# Altium project EDU_High-Speed-Design.PrjPcb (part 3 of 5)

## Sheet EDU_High-Speed-Design_CPU_SATA.SchDoc: CPU SATA
size 279 x 215 mm; Date: not used; ApprovedBy: not used; CheckedBy: not used; Author: not used; DrawnBy: not used; Engineer: Podlesnyi Vasilii; Organization: not used; Address4: not used; Revision: 0.1; SheetNumber: 22; SheetTotal: 26; ProjectTitle: EDU High-Speed Design; Time: not used; ImagePath: not used; Application_BuildNumber: not used
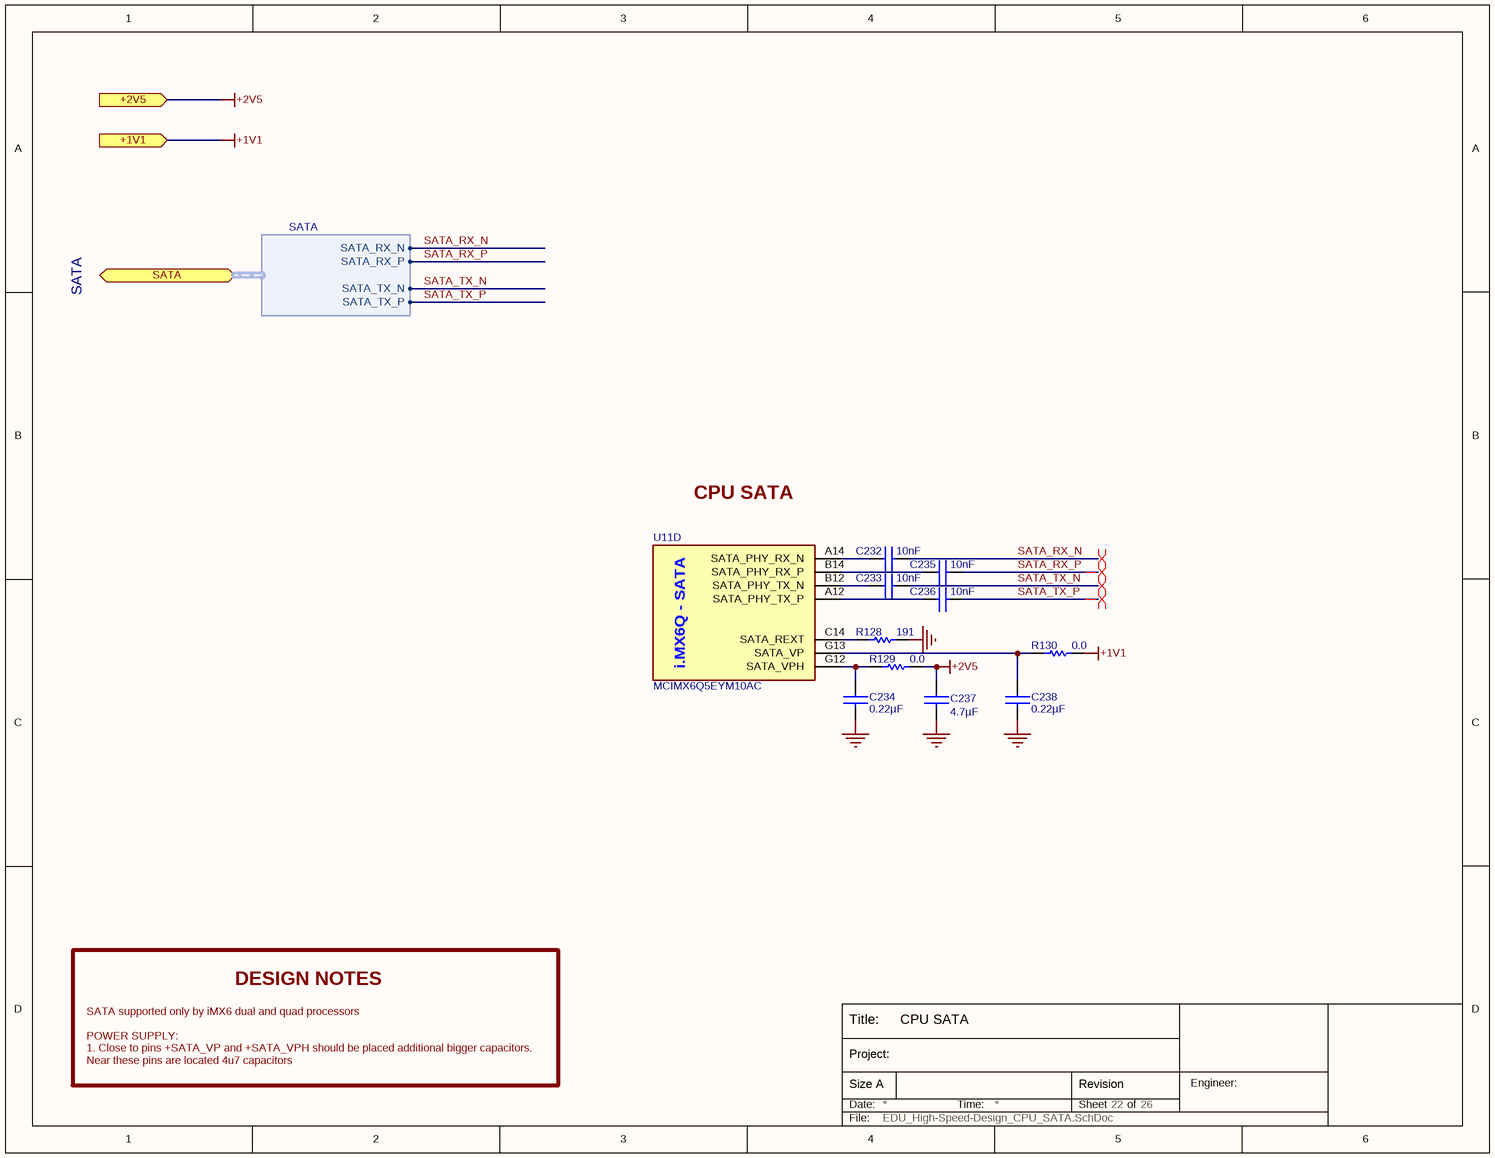
[diagram p19: EDU_High-Speed-Design_CPU_SATA.SchDoc]

### Parts
C232  10nF  [C0402]
C233  10nF  [C0402]
C234  0.22µF  [C0402]
C235  10nF  [C0402]
C236  10nF  [C0402]
C237  4.7µF  [C0402]
C238  0.22µF  [C0402]
R128  191  [R0402]
R129  0.0  [R0402]
R130  0.0  [R0402]
U11  MCIMX6Q5EYM10AC  [MCIMX6Q5EYM10AC]  (part D of 15)

### Ports
+1V1 (in), +2V5 (in), SATA (bidir, harness SATA)

### Harnesses
SATA: SATA_RX_N, SATA_TX_N, SATA_RX_P, SATA_TX_P

### Nets
+1V1: R130.2 ; port +1V1
+2V5: C237.1 R129.2 ; port +2V5
GND: C234.2 C237.2 C238.2 R128.1
SATA_RX_N: C232.2 ; port SATA.SATA_RX_N
SATA_RX_P: C235.2 ; port SATA.SATA_RX_P
SATA_TX_N: C233.2 ; port SATA.SATA_TX_N
SATA_TX_P: C236.2 ; port SATA.SATA_TX_P
NetC232_1: C232.1 U11.A14(SATA_PHY_RX_N)
NetC233_1: C233.1 U11.B12(SATA_PHY_TX_N)
NetC234_1: C234.1 R129.1 U11.G12(SATA_VPH)
NetC235_1: C235.1 U11.B14(SATA_PHY_RX_P)
NetC236_1: C236.1 U11.A12(SATA_PHY_TX_P)
NetC238_1: C238.1 R130.1 U11.G13(SATA_VP)
NetR128_2: R128.2 U11.C14(SATA_REXT)

### Layout directives
differential pair: SATA_RX_N, SATA_RX_P, SATA_TX_N, SATA_TX_P

### Notes on the sheet
- SATA
- CPU SATA
- DESIGN NOTES
- SATA supported only by iMX6 dual and quad processors
  POWER SUPPLY:
  1. Close to pins +SATA_VP and +SATA_VPH should be placed additional bigger capacitors. Near these pins are located 4u7 capacitors
- Title:
- Date:
- Size A
- Project:
- Time:
- Sheet
- Revision
- of
- Engineer:
- File:
- (in symbol MCIMX6Q5EYM10AC, part D) i.MX6Q - SATA

### Library data of the parts
C232 C233 C235 C236 = C1005X7R1H103K: CAP CER 10000PF 50V 10% X7R 0402; Manufacturer: TDK Corporation; Capacitance: 10nF; Manufacturer Part Number: C1005X7R1H103K; Voltage: 50V; Supplier 1: Digi-Key; Supplier Part Number 1: 445-6850-1-ND; ComponentLink1URL: http://www.tdk.co.jp/tefe02/e412_c.pdf; ComponentLink1Description: http://www.tdk.co.jp/tefe02/e412_c.pdf
C234 C238 = C1005X5R1E224M: as C230 on sheet EDU_High-Speed-Design_CPU_LVDS; Capacitance: 0.22µF; Manufacturer Part Number 1: C1005X5R1E224M; Voltage: 25V; Supplier 1: Digi-Key; Supplier Part Number 1: 445-5945-1-ND; ComponentLink1URL: http://www.tdk.co.jp/tefe02/e412_c.pdf; ComponentLink1Description: http://www.tdk.co.jp/tefe02/e412_c.pdf
C237 = C1005X5R1A475M: CAP CER 4.7UF 10V 20% X5R 0402; Manufacturer 1: TDK Corporation; Supplier 1: Digi-Key; Supplier Part Number 1: 445-8023-1-ND; Manufacturer Part Number 1: C1005X5R1A475M; Capacitance: 4.7µF; Voltage: 10V; ComponentLink1URL: http://www.tdk.com/pdf/general_B11.pdf; ComponentLink1Description: http://www.tdk.com/pdf/general_B11.pdf
R128 = CRCW0402191RFKED: RES 191 OHM 1/16W 1% 0402 SMD; Manufacturer: Vishay Dale; Supplier 1: Digi-Key; Manufacturer Part Number: CRCW0402191RFKED; Resistance: 191; ComponentLink1URL: http://www.vishay.com/doc?20035; ComponentLink1Description: http://www.vishay.com/doc?20035; Supplier Part Number 1: 541-191LCT-ND
R129 R130 = RC0402JR-070RL: RES 0.0 OHM 1/16W 0402 SMD; Manufacturer 1: Yageo; Manufacturer Part Number 1: RC0402JR-070RL; Resistance: 0.0; Supplier 1: Digi-Key; Supplier Part Number 1: 311-0.0JRCT-ND; ComponentLink1URL: http://www.yageo.com/documents/recent/PYu-RC0402_51_RoHS_L_6.pdf; ComponentLink1Description: http://www.yageo.com/documents/recent/PYu-RC0402_51_RoHS_L_6.pdf
U11 = MCIMX6Q5EYM10AC: IC MCU 32BIT ARM QUAD 624FCBGA; Manufacturer 1: Freescale Semiconductor; Supplier 1: Digi-Key; Manufacturer Part Number 1: MCIMX6Q5EYM10AC; Supplier Part Number 1: MCIMX6Q5EYM10AC-ND

## Sheet EDU_High-Speed-Design_Connectors.SchDoc: Ethernet
size 431 x 279 mm; Date: not used; ApprovedBy: not used; CheckedBy: not used; Author: not used; DrawnBy: not used; Engineer: Podlesnyi Vasilii; Organization: not used; Address4: not used; Revision: 0.1; SheetNumber: 6; SheetTotal: 26; ProjectTitle: EDU High-Speed Design; Time: not used; ImagePath: not used; Application_BuildNumber: not used
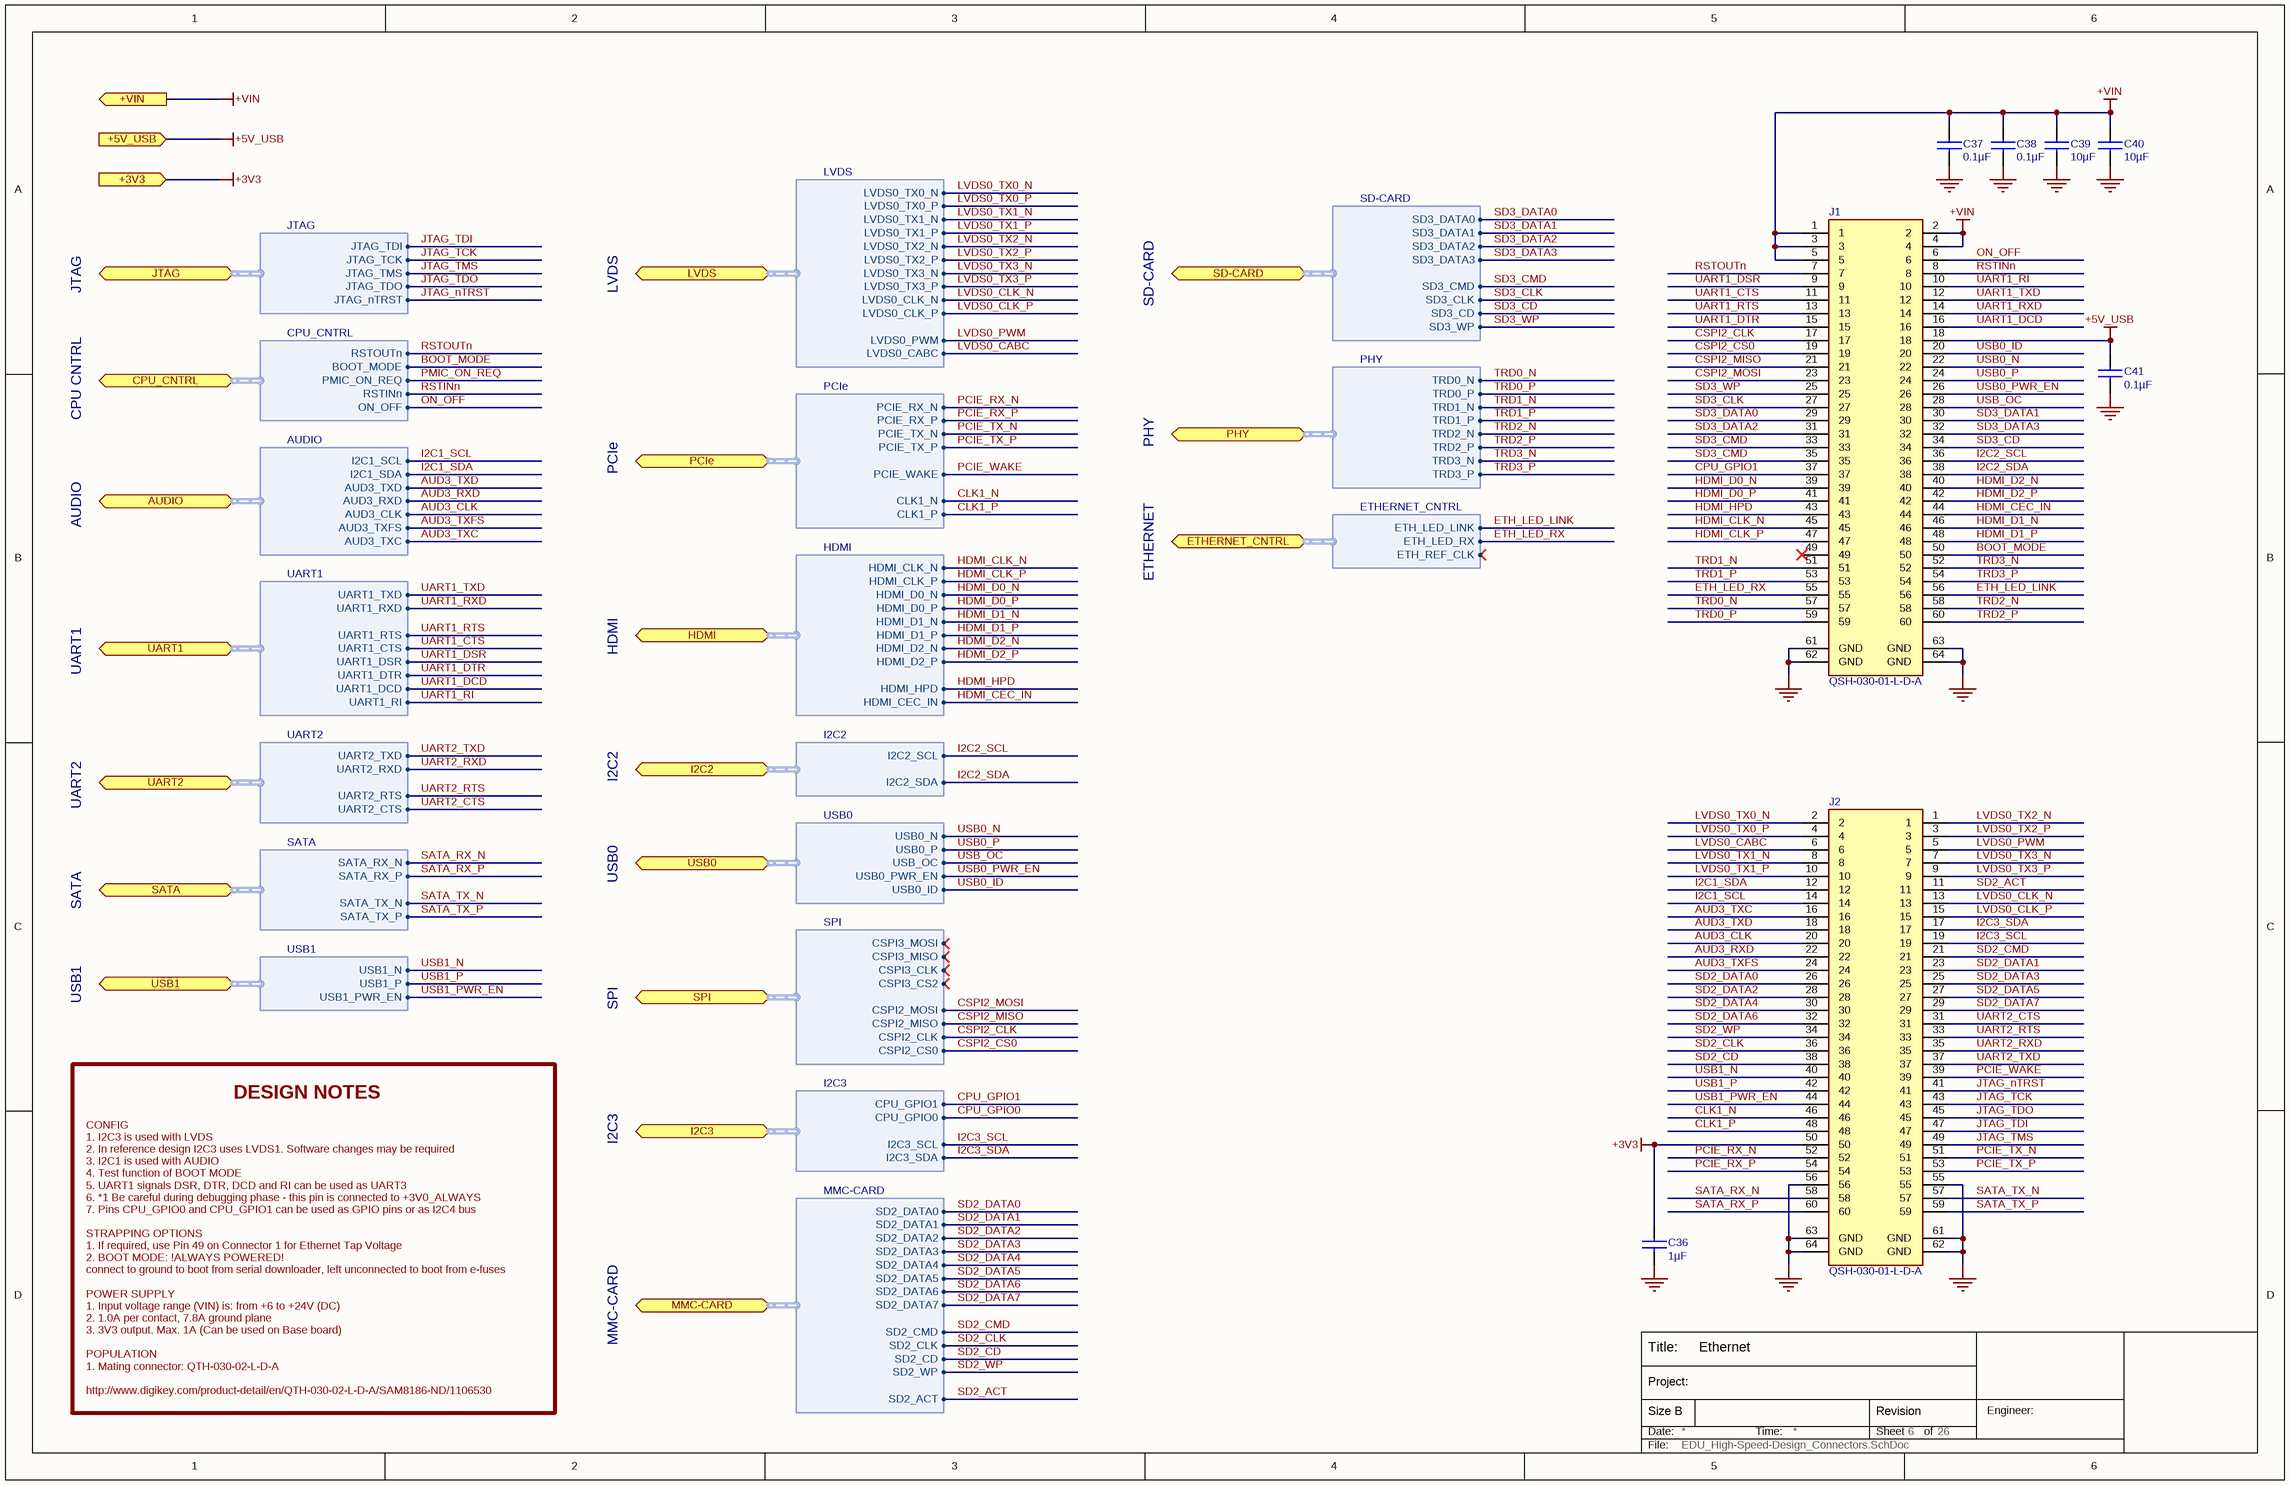
[diagram p20: EDU_High-Speed-Design_Connectors.SchDoc]

### Parts
C36  1µF  [C0402]
C37  0.1µF  [C0402]
C38  0.1µF  [C0402]
C39  10µF  [C1206]
C40  10µF  [C1206]
C41  0.1µF  [C0402]
J1  QSH-030-01-L-D-A  [QSH-030-01-L-D-A]
J2  QSH-030-01-L-D-A  [QSH-030-01-L-D-A]

### Ports
+3V3 (in), +5V_USB (in), +VIN (out), AUDIO (bidir, harness AUDIO), CPU_CNTRL (bidir, harness CPU_CNTRL), ETHERNET_CNTRL (bidir, harness ETHERNET_CNTRL), HDMI (bidir, harness HDMI), I2C2 (bidir, harness I2C2), I2C3 (bidir, harness I2C3), JTAG (bidir, harness JTAG), LVDS (bidir, harness LVDS), MMC-CARD (bidir, harness MMC-CARD), PCIe (bidir, harness PCIe), PHY (bidir, harness PHY), SATA (bidir, harness SATA), SD-CARD (bidir, harness SD-CARD), SPI (bidir, harness SPI), UART1 (bidir, harness UART1), UART2 (bidir, harness UART2), USB0 (bidir, harness USB0), USB1 (bidir, harness USB1)

### Harnesses
JTAG: JTAG_TDI, JTAG_TCK, JTAG_TMS, JTAG_nTRST, JTAG_TDO
CPU_CNTRL: RSTOUTn, PMIC_ON_REQ, ON_OFF, BOOT_MODE, RSTINn
AUDIO: I2C1_SCL, AUD3_TXD, AUD3_RXD, I2C1_SDA, AUD3_CLK, AUD3_TXFS, AUD3_TXC
UART1: UART1_TXD, UART1_RTS, UART1_CTS, UART1_RXD, UART1_DSR, UART1_DTR, UART1_DCD, UART1_RI
UART2: UART2_TXD, UART2_RTS, UART2_CTS, UART2_RXD
SATA: SATA_RX_N, SATA_TX_N, SATA_RX_P, SATA_TX_P
LVDS: LVDS0_TX0_N, LVDS0_TX1_P, LVDS0_TX2_N, LVDS0_TX1_N, LVDS0_TX2_P, LVDS0_TX0_P, LVDS0_TX3_N, LVDS0_TX3_P, LVDS0_CLK_N, LVDS0_CLK_P, LVDS0_PWM, LVDS0_CABC
PCIe: PCIE_RX_N, PCIE_TX_P, PCIE_TX_N, PCIE_WAKE, PCIE_RX_P, CLK1_N, CLK1_P
HDMI: HDMI_CLK_N, HDMI_D0_P, HDMI_D1_N, HDMI_D0_N, HDMI_D1_P, HDMI_CLK_P, HDMI_D2_N, HDMI_D2_P, HDMI_HPD, HDMI_CEC_IN
I2C2: I2C2_SCL, I2C2_SDA
USB0: USB0_N, USB_OC, USB0_PWR_EN, USB0_P, USB0_ID
USB1: USB1_N, USB1_PWR_EN, USB1_P
SPI: CSPI3_MOSI, CSPI3_MISO, CSPI3_CLK, CSPI3_CS2, CSPI2_MOSI, CSPI2_MISO, CSPI2_CLK, CSPI2_CS0
I2C3: CPU_GPIO0, I2C3_SCL, CPU_GPIO1, I2C3_SDA
MMC-CARD: SD2_DATA0, SD2_CLK, SD2_CD, SD2_WP, SD2_CMD, SD2_DATA1, SD2_DATA2, SD2_DATA3, SD2_DATA4, SD2_DATA5, SD2_DATA6, SD2_DATA7, SD2_ACT
SD-CARD: SD3_DATA0, SD3_DATA3, SD3_DATA2, SD3_CLK, SD3_DATA1, SD3_CD, SD3_WP, SD3_CMD
PHY: TRD0_N, TRD0_P, TRD1_N, TRD2_N, TRD2_P, TRD3_N, TRD1_P, TRD3_P
ETHERNET_CNTRL: ETH_LED_LINK, ETH_REF_CLK, ETH_LED_RX

### Nets
+3V3: C36.1 J2.50 ; port +3V3
+5V_USB: C41.1 J1.18 ; port +5V_USB
+VIN: C37.1 C38.1 C39.1 C40.1 J1.1 J1.2 J1.3 J1.4 J1.5 ; port +VIN
GND: C36.2 C37.2 C38.2 C39.2 C40.2 C41.2 J1.61(GND) J1.62(GND) J1.63(GND) J1.64(GND) J2.55 J2.56 J2.61(GND) J2.62(GND) J2.63(GND) J2.64(GND)
AUD3_CLK: J2.20 ; port AUDIO.AUD3_CLK
AUD3_RXD: J2.22 ; port AUDIO.AUD3_RXD
AUD3_TXC: J2.16 ; port AUDIO.AUD3_TXC
AUD3_TXD: J2.18 ; port AUDIO.AUD3_TXD
AUD3_TXFS: J2.24 ; port AUDIO.AUD3_TXFS
BOOT_MODE: J1.50 ; port CPU_CNTRL.BOOT_MODE
CLK1_N: J2.46 ; port PCIe.CLK1_N
CLK1_P: J2.48 ; port PCIe.CLK1_P
CPU_GPIO1: J1.37 ; port I2C3.CPU_GPIO1
CSPI2_CLK: J1.17 ; port SPI.CSPI2_CLK
CSPI2_CS0: J1.19 ; port SPI.CSPI2_CS0
CSPI2_MISO: J1.21 ; port SPI.CSPI2_MISO
CSPI2_MOSI: J1.23 ; port SPI.CSPI2_MOSI
ETH_LED_LINK: J1.56 ; port ETHERNET_CNTRL.ETH_LED_LINK
ETH_LED_RX: J1.55 ; port ETHERNET_CNTRL.ETH_LED_RX
HDMI_CEC_IN: J1.44 ; port HDMI.HDMI_CEC_IN
HDMI_CLK_N: J1.45 ; port HDMI.HDMI_CLK_N
HDMI_CLK_P: J1.47 ; port HDMI.HDMI_CLK_P
HDMI_D0_N: J1.39 ; port HDMI.HDMI_D0_N
HDMI_D0_P: J1.41 ; port HDMI.HDMI_D0_P
HDMI_D1_N: J1.46 ; port HDMI.HDMI_D1_N
HDMI_D1_P: J1.48 ; port HDMI.HDMI_D1_P
HDMI_D2_N: J1.40 ; port HDMI.HDMI_D2_N
HDMI_D2_P: J1.42 ; port HDMI.HDMI_D2_P
HDMI_HPD: J1.43 ; port HDMI.HDMI_HPD
I2C1_SCL: J2.14 ; port AUDIO.I2C1_SCL
I2C1_SDA: J2.12 ; port AUDIO.I2C1_SDA
I2C2_SCL: J1.36 ; port I2C2.I2C2_SCL
I2C2_SDA: J1.38 ; port I2C2.I2C2_SDA
I2C3_SCL: J2.19 ; port I2C3.I2C3_SCL
I2C3_SDA: J2.17 ; port I2C3.I2C3_SDA
JTAG_nTRST: J2.41 ; port JTAG.JTAG_nTRST
JTAG_TCK: J2.43 ; port JTAG.JTAG_TCK
JTAG_TDI: J2.47 ; port JTAG.JTAG_TDI
JTAG_TDO: J2.45 ; port JTAG.JTAG_TDO
JTAG_TMS: J2.49 ; port JTAG.JTAG_TMS
LVDS0_CABC: J2.6 ; port LVDS.LVDS0_CABC
LVDS0_CLK_N: J2.13 ; port LVDS.LVDS0_CLK_N
LVDS0_CLK_P: J2.15 ; port LVDS.LVDS0_CLK_P
LVDS0_PWM: J2.5 ; port LVDS.LVDS0_PWM
LVDS0_TX0_N: J2.2 ; port LVDS.LVDS0_TX0_N
LVDS0_TX0_P: J2.4 ; port LVDS.LVDS0_TX0_P
LVDS0_TX1_N: J2.8 ; port LVDS.LVDS0_TX1_N
LVDS0_TX1_P: J2.10 ; port LVDS.LVDS0_TX1_P
LVDS0_TX2_N: J2.1 ; port LVDS.LVDS0_TX2_N
LVDS0_TX2_P: J2.3 ; port LVDS.LVDS0_TX2_P
LVDS0_TX3_N: J2.7 ; port LVDS.LVDS0_TX3_N
LVDS0_TX3_P: J2.9 ; port LVDS.LVDS0_TX3_P
ON_OFF: J1.6 ; port CPU_CNTRL.ON_OFF
PCIE_RX_N: J2.52 ; port PCIe.PCIE_RX_N
PCIE_RX_P: J2.54 ; port PCIe.PCIE_RX_P
PCIE_TX_N: J2.51 ; port PCIe.PCIE_TX_N
PCIE_TX_P: J2.53 ; port PCIe.PCIE_TX_P
PCIE_WAKE: J2.39 ; port PCIe.PCIE_WAKE
RSTINn: J1.8 ; port CPU_CNTRL.RSTINn
RSTOUTn: J1.7 ; port CPU_CNTRL.RSTOUTn
SATA_RX_N: J2.58 ; port SATA.SATA_RX_N
SATA_RX_P: J2.60 ; port SATA.SATA_RX_P
SATA_TX_N: J2.57 ; port SATA.SATA_TX_N
SATA_TX_P: J2.59 ; port SATA.SATA_TX_P
SD2_ACT: J2.11 ; port MMC-CARD.SD2_ACT
SD2_CD: J2.38 ; port MMC-CARD.SD2_CD
SD2_CLK: J2.36 ; port MMC-CARD.SD2_CLK
SD2_CMD: J2.21 ; port MMC-CARD.SD2_CMD
SD2_DATA0: J2.26 ; port MMC-CARD.SD2_DATA0
SD2_DATA1: J2.23 ; port MMC-CARD.SD2_DATA1
SD2_DATA2: J2.28 ; port MMC-CARD.SD2_DATA2
SD2_DATA3: J2.25 ; port MMC-CARD.SD2_DATA3
SD2_DATA4: J2.30 ; port MMC-CARD.SD2_DATA4
SD2_DATA5: J2.27 ; port MMC-CARD.SD2_DATA5
SD2_DATA6: J2.32 ; port MMC-CARD.SD2_DATA6
SD2_DATA7: J2.29 ; port MMC-CARD.SD2_DATA7
SD2_WP: J2.34 ; port MMC-CARD.SD2_WP
SD3_CD: J1.34 ; port SD-CARD.SD3_CD
SD3_CLK: J1.27 ; port SD-CARD.SD3_CLK
SD3_CMD: J1.33 J1.35 ; port SD-CARD.SD3_CMD
SD3_DATA0: J1.29 ; port SD-CARD.SD3_DATA0
SD3_DATA1: J1.30 ; port SD-CARD.SD3_DATA1
SD3_DATA2: J1.31 ; port SD-CARD.SD3_DATA2
SD3_DATA3: J1.32 ; port SD-CARD.SD3_DATA3
SD3_WP: J1.25 ; port SD-CARD.SD3_WP
TRD0_N: J1.57 ; port PHY.TRD0_N
TRD0_P: J1.59 ; port PHY.TRD0_P
TRD1_N: J1.51 ; port PHY.TRD1_N
TRD1_P: J1.53 ; port PHY.TRD1_P
TRD2_N: J1.58 ; port PHY.TRD2_N
TRD2_P: J1.60 ; port PHY.TRD2_P
TRD3_N: J1.52 ; port PHY.TRD3_N
TRD3_P: J1.54 ; port PHY.TRD3_P
UART1_CTS: J1.11 ; port UART1.UART1_CTS
UART1_DCD: J1.16 ; port UART1.UART1_DCD
UART1_DSR: J1.9 ; port UART1.UART1_DSR
UART1_DTR: J1.15 ; port UART1.UART1_DTR
UART1_RI: J1.10 ; port UART1.UART1_RI
UART1_RTS: J1.13 ; port UART1.UART1_RTS
UART1_RXD: J1.14 ; port UART1.UART1_RXD
UART1_TXD: J1.12 ; port UART1.UART1_TXD
UART2_CTS: J2.31 ; port UART2.UART2_CTS
UART2_RTS: J2.33 ; port UART2.UART2_RTS
UART2_RXD: J2.35 ; port UART2.UART2_RXD
UART2_TXD: J2.37 ; port UART2.UART2_TXD
USB0_ID: J1.20 ; port USB0.USB0_ID
USB0_N: J1.22 ; port USB0.USB0_N
USB0_P: J1.24 ; port USB0.USB0_P
USB0_PWR_EN: J1.26 ; port USB0.USB0_PWR_EN
USB1_N: J2.40 ; port USB1.USB1_N
USB1_P: J2.42 ; port USB1.USB1_P
USB1_PWR_EN: J2.44 ; port USB1.USB1_PWR_EN
USB_OC: J1.28 ; port USB0.USB_OC

Not connected (* = marked no-connect by the designer): J1 49* 65(HOLE1) 66(HOLE2); J2 65(HOLE1) 66(HOLE2)

### Notes on the sheet
- JTAG
- LVDS
- SD-CARD
- CPU CNTRL
- PCIe
- PHY
- AUDIO
- ETHERNET
- UART1
- HDMI
- UART2
- I2C2
- USB0
- SATA
- USB1
- SPI
- DESIGN NOTES
- I2C3
- MMC-CARD
- CONFIG
  1. I2C3 is used with LVDS
  2. In reference design I2C3 uses LVDS1. Software changes may be required
  3. I2C1 is used with AUDIO
  4. Test function of BOOT MODE
  5. UART1 signals DSR, DTR, DCD and RI can be used as UART3
  6. *1 Be careful during debugging phase - this pin is connected to +3V0_ALWAYS
  7. Pins CPU_GPIO0 and CPU_GPIO1 can be used as GPIO pins or as I2C4 bus
  STRAPPING OPTIONS
  1. If required, use Pin 49 on Connector 1 for Ethernet Tap Voltage
  2. BOOT MODE: !ALWAYS POWERED!
  connect to ground to boot from serial downloader, left unconnected to boot from e-fuses
  POWER SUPPLY
  1. Input voltage range (VIN) is: from +6 to +24V (DC)
  2. 1.0A per contact, 7.8A ground plane
  3. 3V3 output. Max. 1A (Can be used on Base board)
  POPULATION
  1. Mating connector: QTH-030-02-L-D-A
  http://www.digikey.com/product-detail/en/QTH-030-02-L-D-A/SAM8186-ND/1106530
- Title:
- Date:
- Size B
- Project:
- Time:
- Sheet
- Revision
- of
- Engineer:
- File:

### Library data of the parts
C36 = C1005X5R1C105K: CAP CER 1.0UF 16V X5R 0402; Manufacturer 1: TDK Corporation; Capacitance: 1µF; Manufacturer Part Number 1: C1005X5R1C105K; Voltage: 16V; Supplier 1: Digi-Key; Supplier Part Number 1: 445-4978-1-ND; ComponentLink1URL: http://www.tdk.co.jp/tefe02/e412_c.pdf; ComponentLink1Description: http://www.tdk.co.jp/tefe02/e412_c.pdf
C37 C38 C41 = C1005X5R1H104K: CAP CER .10UF 50V X5R 10% 0402; Manufacturer 1: TDK Corporation; Capacitance: 0.1µF; Manufacturer Part Number 1: C1005X5R1H104K; Voltage: 50V; Supplier 1: Digi-Key; Supplier Part Number 1: 445-5942-1-ND; ComponentLink1URL: http://www.tdk.co.jp/tefe02/e412_c.pdf; ComponentLink1Description: http://www.tdk.co.jp/tefe02/e412_c.pdf
C39 C40 = GRM31CR6YA106KA12L: CAP CER 10UF 35V X5R 1206; Manufacturer 1: Murata Electronics North America; Capacitance: 10µF; Manufacturer Part Number 1: GRM31CR6YA106KA12L; Supplier 1: Digi-Key; Supplier Part Number 1: 490-5524-1-ND; ComponentLink1URL: http://www.murata.com/products/catalog/pdf/c02e.pdf; ComponentLink1Description: http://www.murata.com/products/catalog/pdf/c02e.pdf; Voltage: 35V
J1 J2 = QSH-030-01-L-D-A: CONN RCPT HI-SPD .5MM 60POS DL; Manufacturer 1: Samtec Inc; Manufacturer Part Number 1: QSH-030-01-L-D-A; Supplier 1: Digi-Key; Supplier Part Number 1: SAM8180-ND

## Sheet EDU_High-Speed-Design_Ethernet.SchDoc: Ethernet
size 431 x 279 mm; Date: not used; ApprovedBy: not used; CheckedBy: not used; Author: not used; DrawnBy: not used; Engineer: Podlesnyi Vasilii; Organization: not used; Address4: not used; Revision: 0.1; SheetNumber: 8; SheetTotal: 26; ProjectTitle: EDU High-Speed Design; Time: not used; ImagePath: not used; Application_BuildNumber: not used
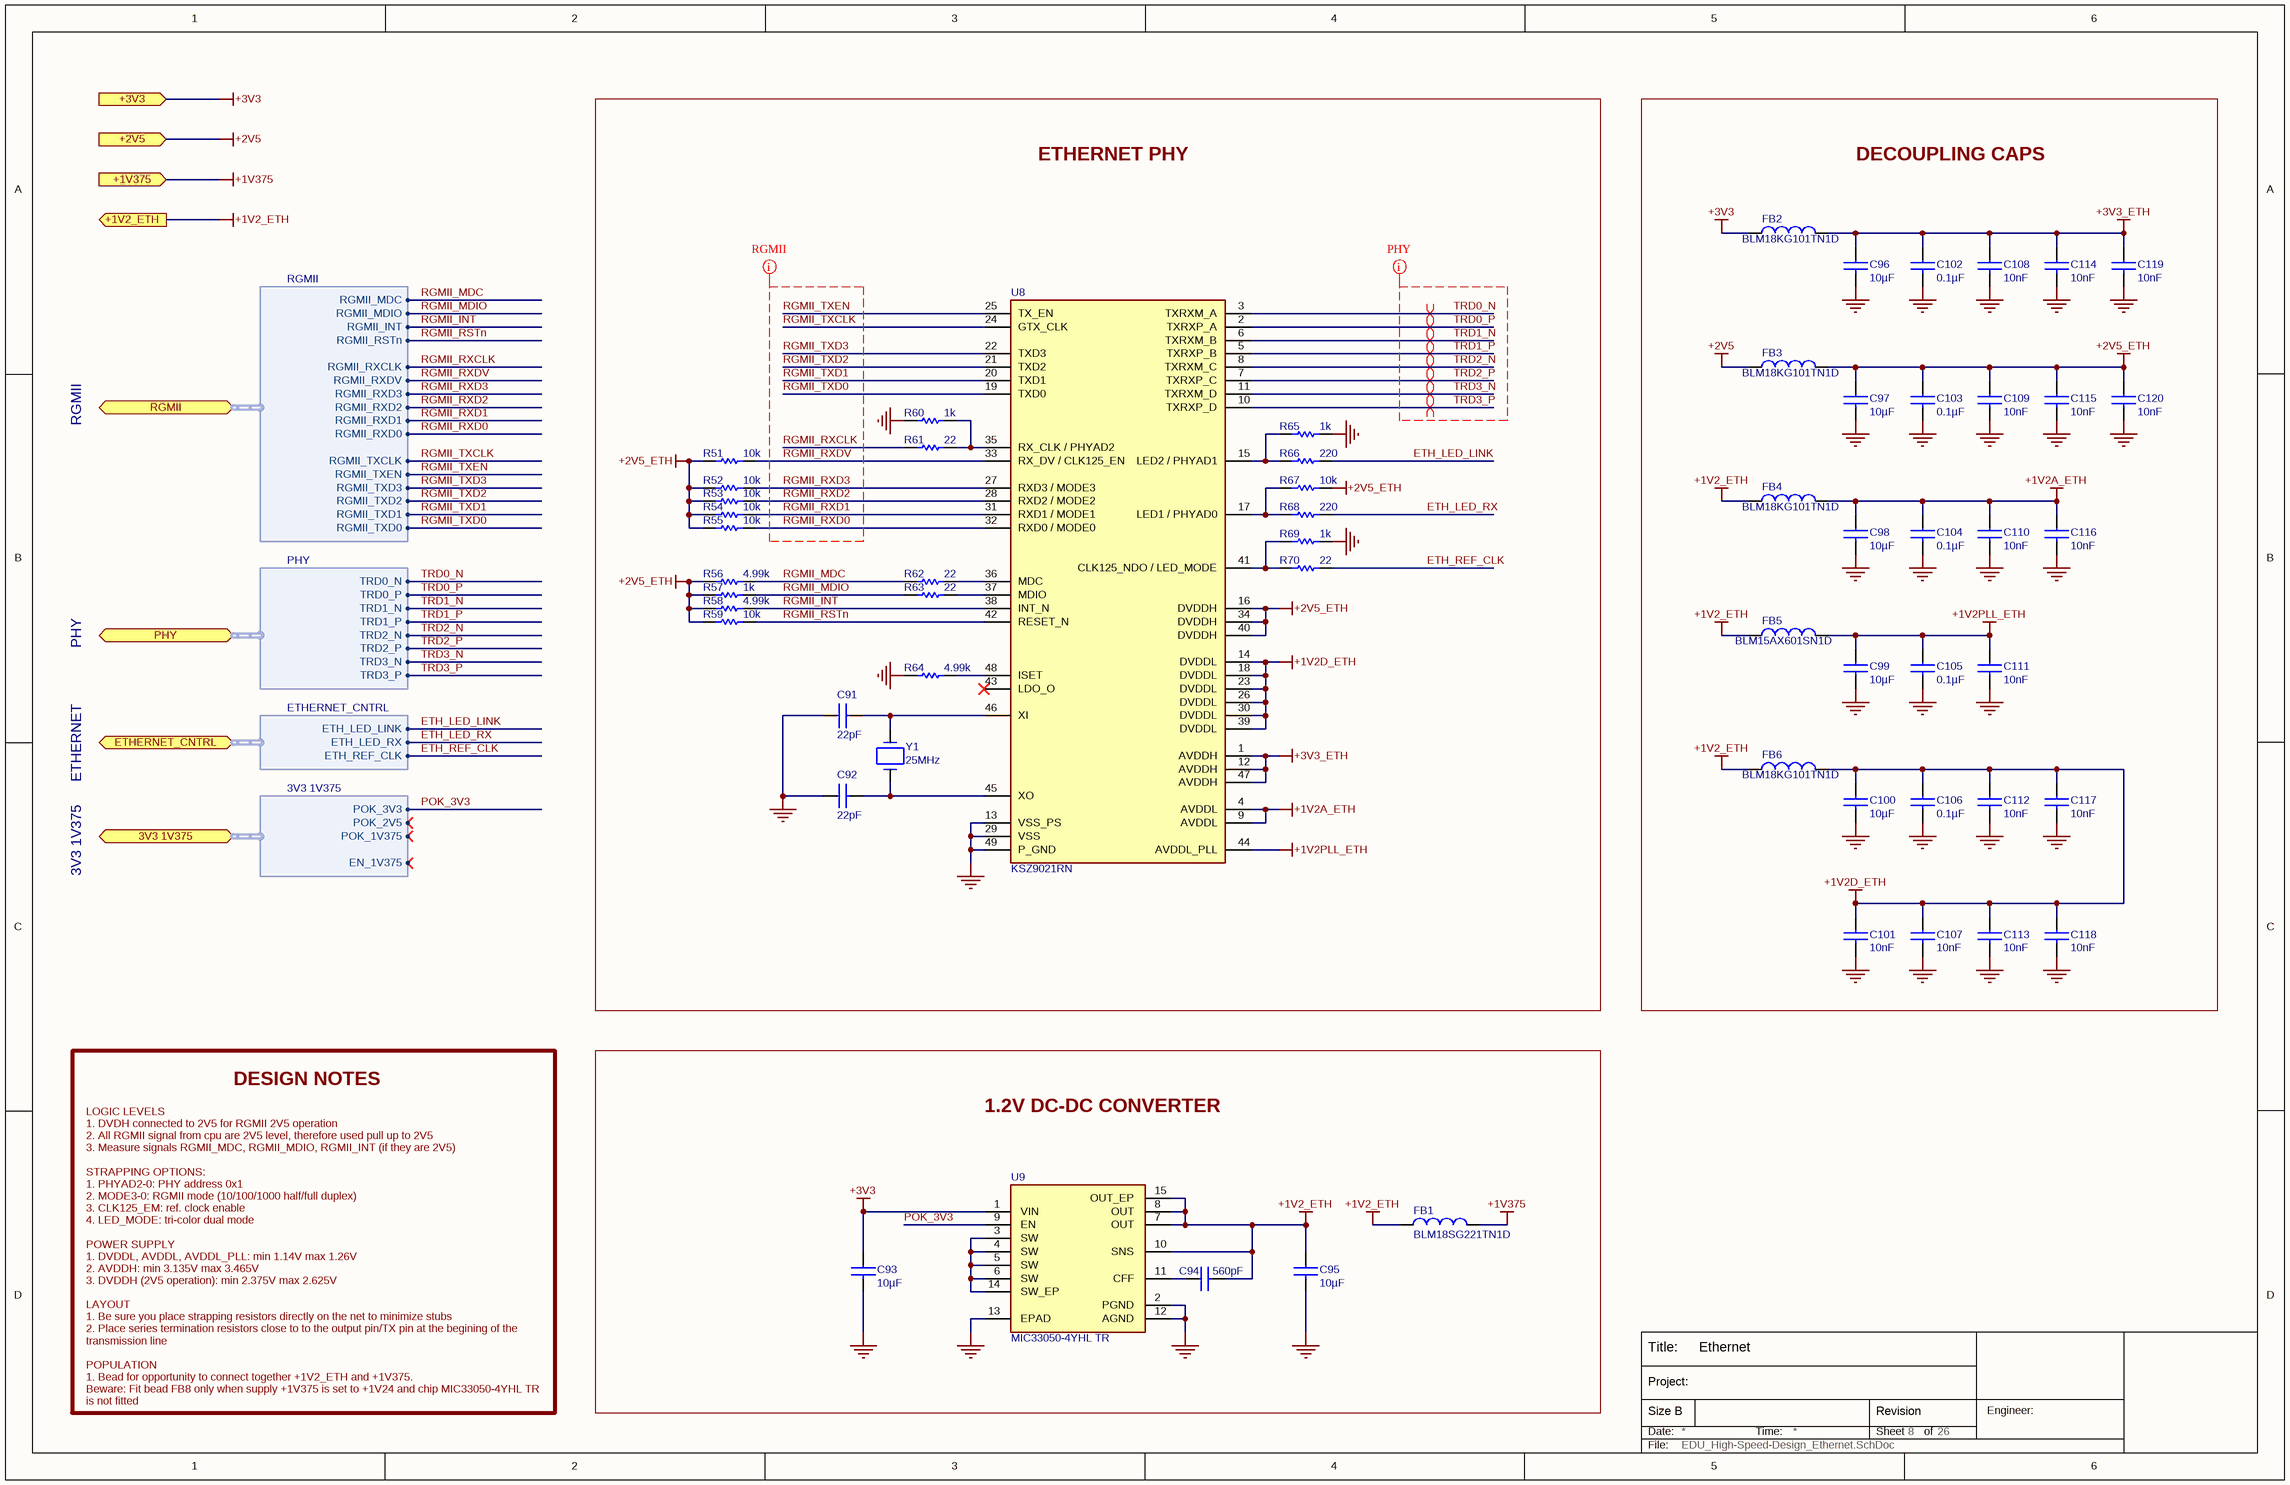
[diagram p21: EDU_High-Speed-Design_Ethernet.SchDoc]

### Parts
C91  22pF  [C0402]
C92  22pF  [C0402]
C93  10µF  [C0603]
C94  560pF  [C0402]
C95  10µF  [C0603]
C96  10µF  [C0603]
C97  10µF  [C0603]
C98  10µF  [C0603]
C99  10µF  [C0603]
C100  10µF  [C0603]
C101  10nF  [C0402]
C102  0.1µF  [C0402]
C103  0.1µF  [C0402]
C104  0.1µF  [C0402]
C105  0.1µF  [C0402]
C106  0.1µF  [C0402]
C107  10nF  [C0402]
C108  10nF  [C0402]
C109  10nF  [C0402]
C110  10nF  [C0402]
C111  10nF  [C0402]
C112  10nF  [C0402]
C113  10nF  [C0402]
C114  10nF  [C0402]
C115  10nF  [C0402]
C116  10nF  [C0402]
C117  10nF  [C0402]
C118  10nF  [C0402]
C119  10nF  [C0402]
C120  10nF  [C0402]
FB1  BLM18SG221TN1D  [L0603]
FB2  BLM18KG101TN1D  [L0603]
FB3  BLM18KG101TN1D  [L0603]
FB4  BLM18KG101TN1D  [L0603]
FB5  BLM15AX601SN1D  [L0402]
FB6  BLM18KG101TN1D  [L0603]
R51  10k  [R0402]
R52  10k  [R0402]
R53  10k  [R0402]
R54  10k  [R0402]
R55  10k  [R0402]
R56  4.99k  [R0402]
R57  1k  [R0402]
R58  4.99k  [R0402]
R59  10k  [R0402]
R60  1k  [R0402]
R61  22  [R0402]
R62  22  [R0402]
R63  22  [R0402]
R64  4.99k  [R0402]
R65  1k  [R0402]
R66  220  [R0402]
R67  10k  [R0402]
R68  220  [R0402]
R69  1k  [R0402]
R70  22  [R0402]
U8  KSZ9021RN  [KSZ9021RN]
U9  MIC33050-4YHL TR  [MIC33050-4YHL TR]
Y1  25MHz  [ABM7]

### Blocks framed on the sheet
ETHERNET PHY: C91 C92 R51-R70 U8 Y1
DECOUPLING CAPS: C96-C120 FB2-FB6
1.2V DC-DC CONVERTER: C93-C95 FB1 U9

### Ports
3V3 1V375 (bidir, harness 3V3 1V375), +1V2_ETH (out), +1V375 (in), +2V5 (in), +3V3 (in), ETHERNET_CNTRL (bidir, harness ETHERNET_CNTRL), PHY (bidir, harness PHY), RGMII (bidir, harness RGMII)

### Harnesses
RGMII: RGMII_TXCLK, RGMII_TXEN, RGMII_TXD2, RGMII_TXD0, RGMII_TXD1, RGMII_TXD3, RGMII_RXDV, RGMII_RXCLK, RGMII_RXD3, RGMII_RXD2, RGMII_RXD1, RGMII_RXD0, RGMII_RSTn, RGMII_INT, RGMII_MDIO, RGMII_MDC
PHY: TRD0_N, TRD0_P, TRD1_N, TRD2_N, TRD2_P, TRD3_N, TRD1_P, TRD3_P
ETHERNET_CNTRL: ETH_LED_LINK, ETH_REF_CLK, ETH_LED_RX
3V3 1V375: POK_3V3, POK_1V375, POK_2V5, EN_1V375

### Nets
+1V2_ETH: C94.2 C95.1 FB1.1 FB4.1 FB5.1 FB6.1 U9.7(OUT) U9.8(OUT) U9.10(SNS) U9.15(OUT_EP) ; port +1V2_ETH
+1V2A_ETH: C98.1 C104.1 C110.1 C116.1 FB4.2 U8.4(AVDDL) U8.9(AVDDL)
+1V2D_ETH: C100.1 C101.1 C106.1 C107.1 C112.1 C113.1 C117.1 C118.1 FB6.2 U8.14(DVDDL) U8.18(DVDDL) U8.23(DVDDL) U8.26(DVDDL) U8.30(DVDDL) U8.39(DVDDL)
+1V2PLL_ETH: C99.1 C105.1 C111.1 FB5.2 U8.44(AVDDL_PLL)
+1V375: FB1.2 ; port +1V375
+2V5: FB3.1 ; port +2V5
+2V5_ETH: C97.1 C103.1 C109.1 C115.1 C120.1 FB3.2 R51.1 R52.1 R53.1 R54.1 R55.1 R56.2 R57.2 R58.2 R59.1 R67.2 U8.16(DVDDH) U8.34(DVDDH) U8.40(DVDDH)
+3V3: C93.1 FB2.1 U9.1(VIN) ; port +3V3
+3V3_ETH: C96.1 C102.1 C108.1 C114.1 C119.1 FB2.2 U8.1(AVDDH) U8.12(AVDDH) U8.47(AVDDH)
GND: C91.1 C92.1 C93.2 C95.2 C96.2 C97.2 C98.2 C99.2 C100.2 C101.2 C102.2 C103.2 C104.2 C105.2 C106.2 C107.2 C108.2 C109.2 C110.2 C111.2 C112.2 C113.2 C114.2 C115.2 C116.2 C117.2 C118.2 C119.2 C120.2 R60.2 R64.2 R65.1 R69.1 U8.13(VSS_PS) U8.29(VSS) U8.49(P_GND) U9.2(PGND) U9.12(AGND) U9.13(EPAD)
ETH_LED_LINK: R66.1 ; port ETHERNET_CNTRL.ETH_LED_LINK
ETH_LED_RX: R68.1 ; port ETHERNET_CNTRL.ETH_LED_RX
ETH_REF_CLK: R70.1 ; port ETHERNET_CNTRL.ETH_REF_CLK
POK_3V3: U9.9(EN) ; port 3V3 1V375.POK_3V3
RGMII_INT: R58.1 U8.38(INT_N) ; port RGMII.RGMII_INT
RGMII_MDC: R56.1 R62.2 ; port RGMII.RGMII_MDC
RGMII_MDIO: R57.1 R63.2 ; port RGMII.RGMII_MDIO
RGMII_RSTn: R59.2 U8.42(RESET_N) ; port RGMII.RGMII_RSTn
RGMII_RXCLK: R61.2 ; port RGMII.RGMII_RXCLK
RGMII_RXD0: R55.2 U8.32(RXD0_/_MODE0) ; port RGMII.RGMII_RXD0
RGMII_RXD1: R54.2 U8.31(RXD1_/_MODE1) ; port RGMII.RGMII_RXD1
RGMII_RXD2: R53.2 U8.28(RXD2_/_MODE2) ; port RGMII.RGMII_RXD2
RGMII_RXD3: R52.2 U8.27(RXD3_/_MODE3) ; port RGMII.RGMII_RXD3
RGMII_RXDV: R51.2 U8.33(RX_DV_/_CLK125_EN) ; port RGMII.RGMII_RXDV
RGMII_TXCLK: U8.24(GTX_CLK) ; port RGMII.RGMII_TXCLK
RGMII_TXD0: U8.19(TXD0) ; port RGMII.RGMII_TXD0
RGMII_TXD1: U8.20(TXD1) ; port RGMII.RGMII_TXD1
RGMII_TXD2: U8.21(TXD2) ; port RGMII.RGMII_TXD2
RGMII_TXD3: U8.22(TXD3) ; port RGMII.RGMII_TXD3
RGMII_TXEN: U8.25(TX_EN) ; port RGMII.RGMII_TXEN
TRD0_N: U8.3(TXRXM_A) ; port PHY.TRD0_N
TRD0_P: U8.2(TXRXP_A) ; port PHY.TRD0_P
TRD1_N: U8.6(TXRXM_B) ; port PHY.TRD1_N
TRD1_P: U8.5(TXRXP_B) ; port PHY.TRD1_P
TRD2_N: U8.8(TXRXM_C) ; port PHY.TRD2_N
TRD2_P: U8.7(TXRXP_C) ; port PHY.TRD2_P
TRD3_N: U8.11(TXRXM_D) ; port PHY.TRD3_N
TRD3_P: U8.10(TXRXP_D) ; port PHY.TRD3_P
NetC91_2: C91.2 U8.46(XI) Y1.2
NetC92_2: C92.2 U8.45(XO) Y1.1
NetC94_1: C94.1 U9.11(CFF)
NetR60_1: R60.1 R61.1 U8.35(RX_CLK_/_PHYAD2)
NetR62_1: R62.1 U8.36(MDC)
NetR63_1: R63.1 U8.37(MDIO)
NetR64_1: R64.1 U8.48(ISET)
NetR65_2: R65.2 R66.2 U8.15(LED2_/_PHYAD1)
NetR67_1: R67.1 R68.2 U8.17(LED1_/_PHYAD0)
NetR69_2: R69.2 R70.2 U8.41(CLK125_NDO_/_LED_MODE)
NetU9_3: U9.3(SW) U9.4(SW) U9.5(SW) U9.6(SW) U9.14(SW_EP)

Not connected (* = marked no-connect by the designer): U8 43(LDO_O)*

### Layout directives
net class RGMII; rule Impedance Constraint [Min = 45.00    Max = 55.00    ]; rule Matched Net Lengths [Tolerance = 25mil]: RGMII_RXCLK, RGMII_RXD0, RGMII_RXD1, RGMII_RXD2, RGMII_RXD3, RGMII_RXDV, RGMII_TXCLK, RGMII_TXD0, RGMII_TXD1, RGMII_TXD2, RGMII_TXD3, RGMII_TXEN
differential pair: TRD0_N, TRD0_P, TRD1_N, TRD1_P, TRD2_N, TRD2_P, TRD3_N, TRD3_P
net class PHY; rule Impedance Constraint [Min = 90.00    Max = 110.0    ]; rule Matched Net Lengths [Tolerance = 50mil]: TRD0_N, TRD0_P, TRD1_N, TRD1_P, TRD2_N, TRD2_P, TRD3_N, TRD3_P

### Notes on the sheet
- RGMII
- PHY
- ETHERNET
- 3V3 1V375
- DESIGN NOTES
- LOGIC LEVELS
  1. DVDH connected to 2V5 for RGMII 2V5 operation
  2. All RGMII signal from cpu are 2V5 level, therefore used pull up to 2V5
  3. Measure signals RGMII_MDC, RGMII_MDIO, RGMII_INT (if they are 2V5)
  STRAPPING OPTIONS:
  1. PHYAD2-0: PHY address 0x1
  2. MODE3-0: RGMII mode (10/100/1000 half/full duplex)
  3. CLK125_EM: ref. clock enable
  4. LED_MODE: tri-color dual mode
  POWER SUPPLY
  1. DVDDL, AVDDL, AVDDL_PLL: min 1.14V max 1.26V
  2. AVDDH: min 3.135V max 3.465V
  3. DVDDH (2V5 operation): min 2.375V max 2.625V
  LAYOUT
  1. Be sure you place strapping resistors directly on the net to minimize stubs
  2. Place series termination resistors close to to the output pin/TX pin at the begining of the transmission line
  POPULATION
  1. Bead for opportunity to connect together +1V2_ETH and +1V375.
  Beware: Fit bead FB8 only when supply +1V375 is set to +1V24 and chip MIC33050-4YHL TR is not fitted
- Title:
- Date:
- Size B
- Project:
- Time:
- Sheet
- Revision
- of
- Engineer:
- File:

### Library data of the parts
C91 C92 = C1005C0G1H220J: CAP CER 22PF 50V C0G 5% 0402; Manufacturer 1: TDK Corporation; Capacitance: 22pF; Manufacturer Part Number 1: C1005C0G1H220J; Supplier 1: Digi-Key; Supplier Part Number 1: 445-1239-1-ND; ComponentLink1URL: http://www.tdk.co.jp/tefe02/e412_c.pdf; ComponentLink1Description: http://www.tdk.co.jp/tefe02/e412_c.pdf; Voltage: 50V
C93 C95-C100 = C1608X5R0J106M: CAP CER 10UF 6.3V X5R 20% 0603; Manufacturer 1: TDK Corporation; Capacitance: 10µF; Manufacturer Part Number 1: C1608X5R0J106M; Voltage: 6.3V; Supplier 1: Digi-Key; Supplier Part Number 1: 445-4112-1-ND; ComponentLink1URL: http://www.tdk.com/pdf/general_B11.pdf; ComponentLink1Description: http://www.tdk.com/pdf/general_B11.pdf
C94 = GRM1555C1H561JA01D: CAP CER 560PF 50V C0G 0402; Manufacturer 1: Murata Electronics North America; Capacitance: 560pF; Manufacturer Part Number 1: GRM1555C1H561JA01D; Voltage: 50V; Supplier 1: Digi-Key; Supplier Part Number 1: 490-3238-1-ND; ComponentLink1URL: http://search.murata.co.jp/Ceramy/image/img/PDF/ENG/GRM1555C1H561JA01.pdf; ComponentLink1Description: http://search.murata.co.jp/Ceramy/image/img/PDF/ENG/GRM1555C1H561JA01.pdf
C101 C107-C120 = C1005X7R1C103K: CAP CER 10000PF 16V X7R 10% 0402; Manufacturer: TDK Corporation; Capacitance: 10nF; Manufacturer Part Number: C1005X7R1C103K; Voltage: 16V; Supplier 1: Digi-Key; Supplier Part Number 1: 445-1262-1-ND; ComponentLink1URL: http://www.tdk.co.jp/tefe02/e412_c.pdf; ComponentLink1Description: http://www.tdk.co.jp/tefe02/e412_c.pdf
C102-C106 = C1005X5R1H104K: as C37 on sheet EDU_High-Speed-Design_Connectors; Capacitance: 0.1µF; Manufacturer Part Number 1: C1005X5R1H104K; Voltage: 50V; Supplier 1: Digi-Key; Supplier Part Number 1: 445-5942-1-ND; ComponentLink1URL: http://www.tdk.co.jp/tefe02/e412_c.pdf; ComponentLink1Description: http://www.tdk.co.jp/tefe02/e412_c.pdf
FB1 = BLM18SG221TN1D: FERRITE CHIP 220 OHM 2500MA 0603; Manufacturer 1: Murata Electronics North America; Supplier 1: Digi-Key; Supplier Part Number 1: 490-5225-1-ND; Manufacturer Part Number 1: BLM18SG221TN1D; ComponentLink1URL: http://search.murata.co.jp/Ceramy/image/img/PDF/ENG/L0110S0100BLM18S.pdf; ComponentLink1Description: http://search.murata.co.jp/Ceramy/image/img/PDF/ENG/L0110S0100BLM18S.pdf
FB2-FB4 FB6 = BLM18KG101TN1D: FERRITE CHIP 100 OHM BEAD 0603 3A; Manufacturer 1: Murata Electronics North America; Manufacturer Part Number 1: BLM18KG101TN1D; Supplier 1: Digi-Key; Supplier Part Number 1: 490-5448-1-ND; ComponentLink1URL: http://search.murata.co.jp/Ceramy/image/img/PDF/ENG/L0110S0100BLM18K.pdf; ComponentLink1Description: http://search.murata.co.jp/Ceramy/image/img/PDF/ENG/L0110S0100BLM18K.pdf
FB5 = BLM15AX601SN1D: FERRITE CHIP 600 OHM 0402 420mA; Manufacturer 1: Murata Electronics North America; Manufacturer Part Number 1: BLM15AX601SN1D; Supplier 1: Digi-Key; Supplier Part Number 1: 490-5441-1-ND; ComponentLink1URL: http://search.murata.co.jp/Ceramy/image/img/PDF/ENG/L0110S0100BLM15AX_SN.pdf; ComponentLink1Description: http://search.murata.co.jp/Ceramy/image/img/PDF/ENG/L0110S0100BLM15AX_SN.pdf
R51-R55 R59 R67 = RC0402FR-0710KL: RES 10.0K OHM 1/16W 1% 0402 SMD; Manufacturer 1: Yageo; Manufacturer Part Number 1: RC0402FR-0710KL; Resistance: 10k; Supplier 1: Digi-Key; Supplier Part Number 1: 311-10.0KLRCT-ND; ComponentLink1URL: http://www.yageo.com/documents/recent/PYu-RC0402_51_RoHS_L_6.pdf; ComponentLink1Description: http://www.yageo.com/documents/recent/PYu-RC0402_51_RoHS_L_6.pdf
R56 R58 R64 = RMCF0402FT4K99: RES TF 4.99K OHM 1% 1/16W 0402; Manufacturer 1: Stackpole Electronics Inc; Manufacturer Part Number 1: RMCF0402FT4K99; Resistance: 4.99k; Supplier 1: Digi-Key; Supplier Part Number 1: RMCF0402FT4K99CT-ND; ComponentLink1URL: http://www.seielect.com/Catalog/SEI-RMCF.pdf; ComponentLink1Description: http://www.seielect.com/Catalog/SEI-RMCF.pdf
R57 R60 R65 R69 = RC0402FR-071KL: RES 1.00K OHM 1/16W 1% 0402 SMD; Manufacturer 1: Yageo; Manufacturer Part Number 1: RC0402FR-071KL; Resistance: 1k; Supplier 1: Digi-Key; Supplier Part Number 1: 311-1.00KLRCT-ND; ComponentLink1URL: http://www.yageo.com/documents/recent/PYu-RC0402_51_RoHS_L_6.pdf; ComponentLink1Description: http://www.yageo.com/documents/recent/PYu-RC0402_51_RoHS_L_6.pdf
R61-R63 R70 = RC0402FR-0722RL: RES 22.0 OHM 1/16W 1% 0402 SMD; Manufacturer 1: Yageo; Manufacturer Part Number 1: RC0402FR-0722RL; Resistance: 22; Supplier 1: Digi-Key; Supplier Part Number 1: 311-22.0LRCT-ND; ComponentLink1URL: http://www.yageo.com/documents/recent/PYu-RC0402_51_RoHS_L_6.pdf; ComponentLink1Description: http://www.yageo.com/documents/recent/PYu-RC0402_51_RoHS_L_6.pdf
R66 R68 = RC0402FR-07220RL: RES 220 OHM 1/16W 1% 0402 SMD; Manufacturer 1: Yageo; Manufacturer Part Number 1: RC0402FR-07220RL; Resistance: 220; Supplier 1: Digi-Key; Supplier Part Number 1: 311-220LRCT-ND; ComponentLink1URL: http://www.yageo.com/documents/recent/PYu-RC0402_51_RoHS_L_6.pdf; ComponentLink1Description: http://www.yageo.com/documents/recent/PYu-RC0402_51_RoHS_L_6.pdf
U8 = KSZ9021RN: IC TXRX 10/100/1000 SGL 48QFN; Manufacturer 1: Micrel Inc; Supplier 1: Digi-Key; Manufacturer Part Number 1: KSZ9021RN; Supplier Part Number 1: 576-3637-ND
U9 = MIC33050-4YHL TR: IC PWM REG 600mA 1.2V 12-MLF; Manufacturer 1: Micrel Inc; Manufacturer Part Number 1: MIC33050-4YHL TR; Supplier 1: Digi-Key; Supplier Part Number 1: 576-3044-1-ND
Y1 = ABM7-25.000MHZ-D-2-Y-T V1.1: CRYSTAL 25.0000 MHZ 18PF SMD; Manufacturer 1: Abracon Corporation; Manufacturer Part Number 1: ABM7-25.000MHZ-D-2-Y-T; Frequency: 25MHz; Supplier 1: Digi-Key; Supplier Part Number 1: 535-9847-1-ND; ComponentLink1URL: http://www.abracon.com/Resonators/abm7.pdf; ComponentLink1Description: http://www.abracon.com/Resonators/abm7.pdf

## Sheet EDU_High-Speed-Design_Flash.SchDoc: Flash
size 279 x 215 mm; Date: not used; ApprovedBy: not used; CheckedBy: not used; Author: not used; DrawnBy: not used; Engineer: Podlesnyi Vasilii; Organization: not used; Address4: not used; Revision: 0.1; SheetNumber: 9; SheetTotal: 26; ProjectTitle: EDU High-Speed Design; Time: not used; ImagePath: not used; Application_BuildNumber: not used
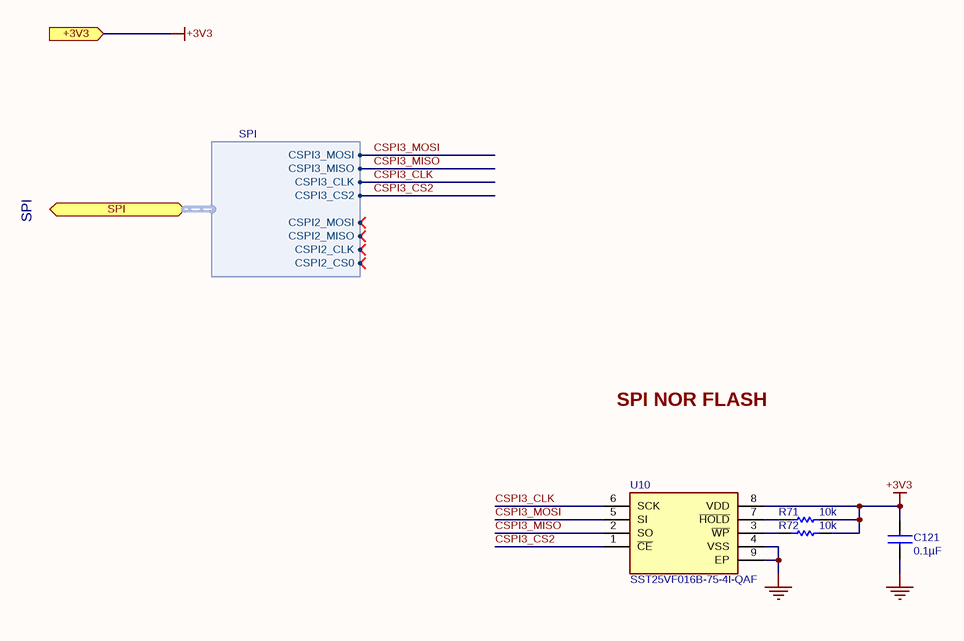
[diagram p22: EDU_High-Speed-Design_Flash.SchDoc]

### Parts
C121  0.1µF  [C0402]
R71  10k  [R0402]
R72  10k  [R0402]
U10  SST25VF016B-75-4I-QAF  [SST25VF016B]

### Ports
+3V3 (in), SPI (bidir, harness SPI)

### Harnesses
SPI: CSPI3_MOSI, CSPI3_MISO, CSPI3_CLK, CSPI3_CS2, CSPI2_MOSI, CSPI2_MISO, CSPI2_CLK, CSPI2_CS0

### Nets
+3V3: C121.1 R71.2 R72.2 U10.8(VDD) ; port +3V3
GND: C121.2 U10.4(VSS) U10.9(EP)
CSPI3_CLK: U10.6(SCK) ; port SPI.CSPI3_CLK
CSPI3_CS2: U10.1(~{CE}) ; port SPI.CSPI3_CS2
CSPI3_MISO: U10.2(SO) ; port SPI.CSPI3_MISO
CSPI3_MOSI: U10.5(SI) ; port SPI.CSPI3_MOSI
NetR71_1: R71.1 U10.7(~{HOLD})
NetR72_1: R72.1 U10.3(~{WP})

### Notes on the sheet
- SPI
- SPI NOR FLASH
- Title:
- Date:
- Size A
- Project:
- Time:
- Sheet
- Revision
- of
- Engineer:
- File:

### Library data of the parts
C121 = C1005X5R1H104K: as C37 on sheet EDU_High-Speed-Design_Connectors; Capacitance: 0.1µF; Manufacturer Part Number 1: C1005X5R1H104K; Voltage: 50V; Supplier 1: Digi-Key; Supplier Part Number 1: 445-5942-1-ND; ComponentLink1URL: http://www.tdk.co.jp/tefe02/e412_c.pdf; ComponentLink1Description: http://www.tdk.co.jp/tefe02/e412_c.pdf
R71 R72 = RC0402FR-0710KL: as R51 on sheet EDU_High-Speed-Design_Ethernet; Manufacturer Part Number 1: RC0402FR-0710KL; Resistance: 10k; Supplier 1: Digi-Key; Supplier Part Number 1: 311-10.0KLRCT-ND; ComponentLink1URL: http://www.yageo.com/documents/recent/PYu-RC0402_51_RoHS_L_6.pdf; ComponentLink1Description: http://www.yageo.com/documents/recent/PYu-RC0402_51_RoHS_L_6.pdf
U10 = SST25VF016B-75-4I-QAF: IC FLASH 16MBIT 75MHZ 8WSON; Manufacturer 1: Microchip Technology; Supplier 1: Digi-Key; Manufacturer Part Number 1: SST25VF016B-75-4I-QAF; ComponentLink1URL: http://ww1.microchip.com/downloads/en/DeviceDoc/25044A.pdf; ComponentLink1Description: http://ww1.microchip.com/downloads/en/DeviceDoc/25044A.pdf; Supplier Part Number 1: SST25VF016B-75-4I-QAF-ND

## Sheet EDU_High-Speed-Design_DDR3.SchDoc: DDR3
size 558 x 431 mm; Date: not used; ApprovedBy: not used; CheckedBy: not used; Author: not used; DrawnBy: not used; Engineer: Podlesnyi Vasilii; Organization: not used; Address4: not used; Revision: 0.1; SheetNumber: 7; SheetTotal: 26; ProjectTitle: EDU High-Speed Design; Time: not used; ImagePath: not used; Application_BuildNumber: not used
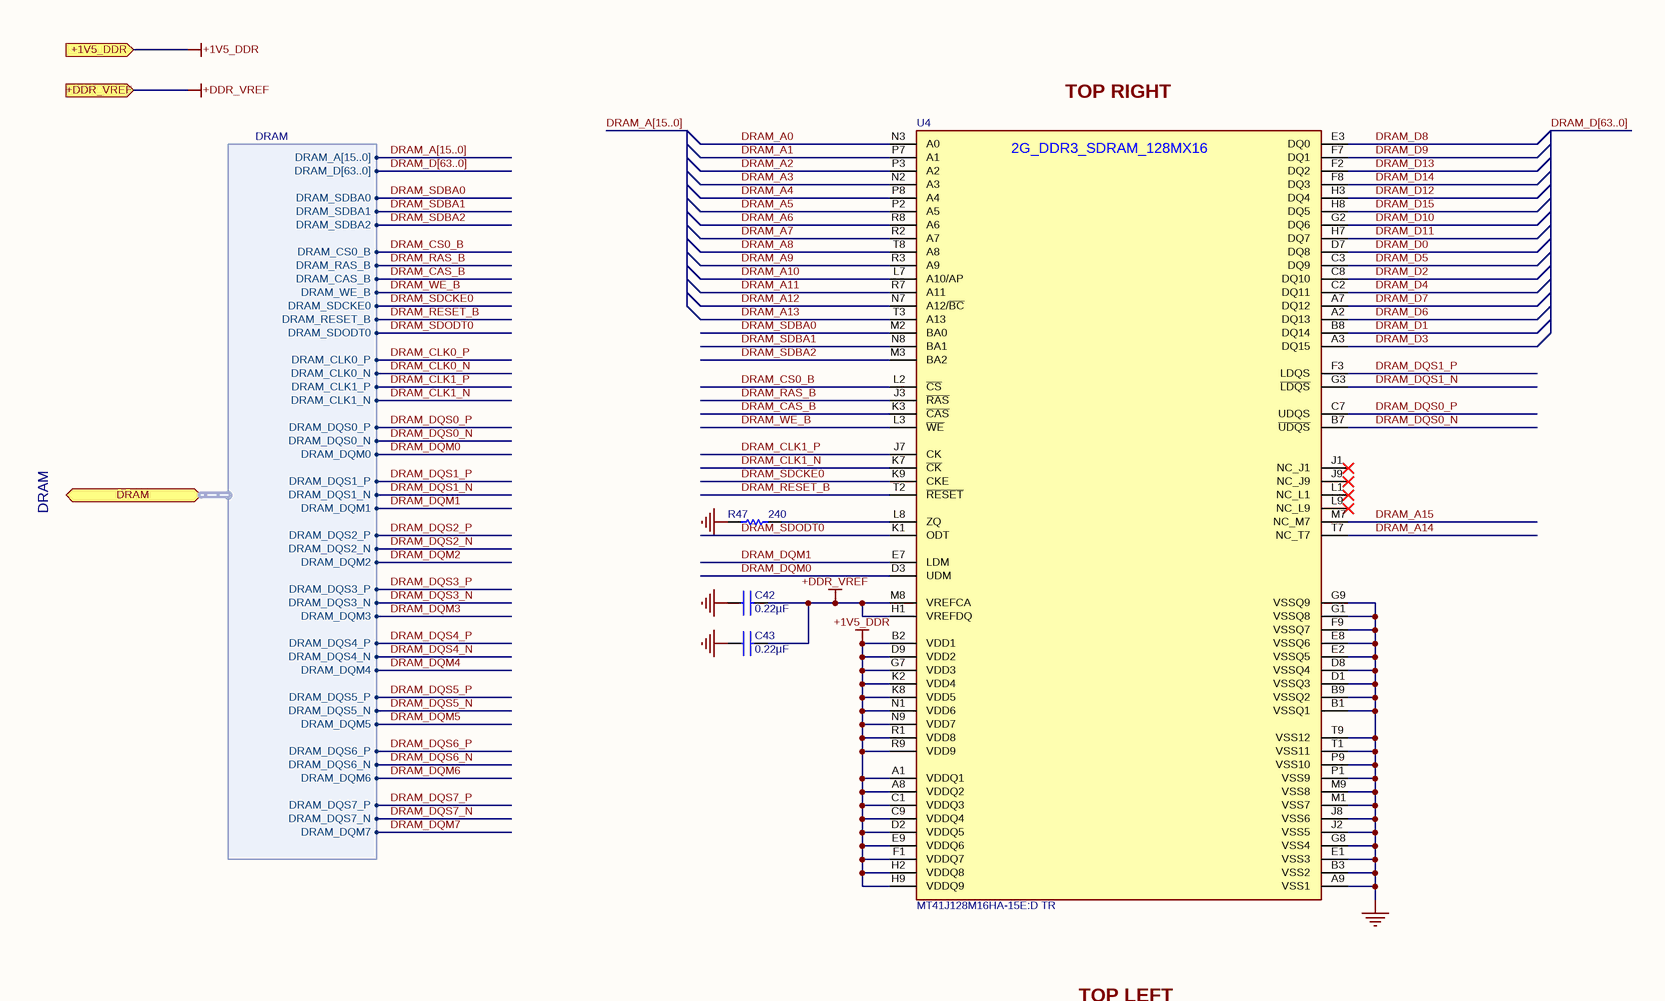
[diagram p23: EDU_High-Speed-Design_DDR3.SchDoc, top left]
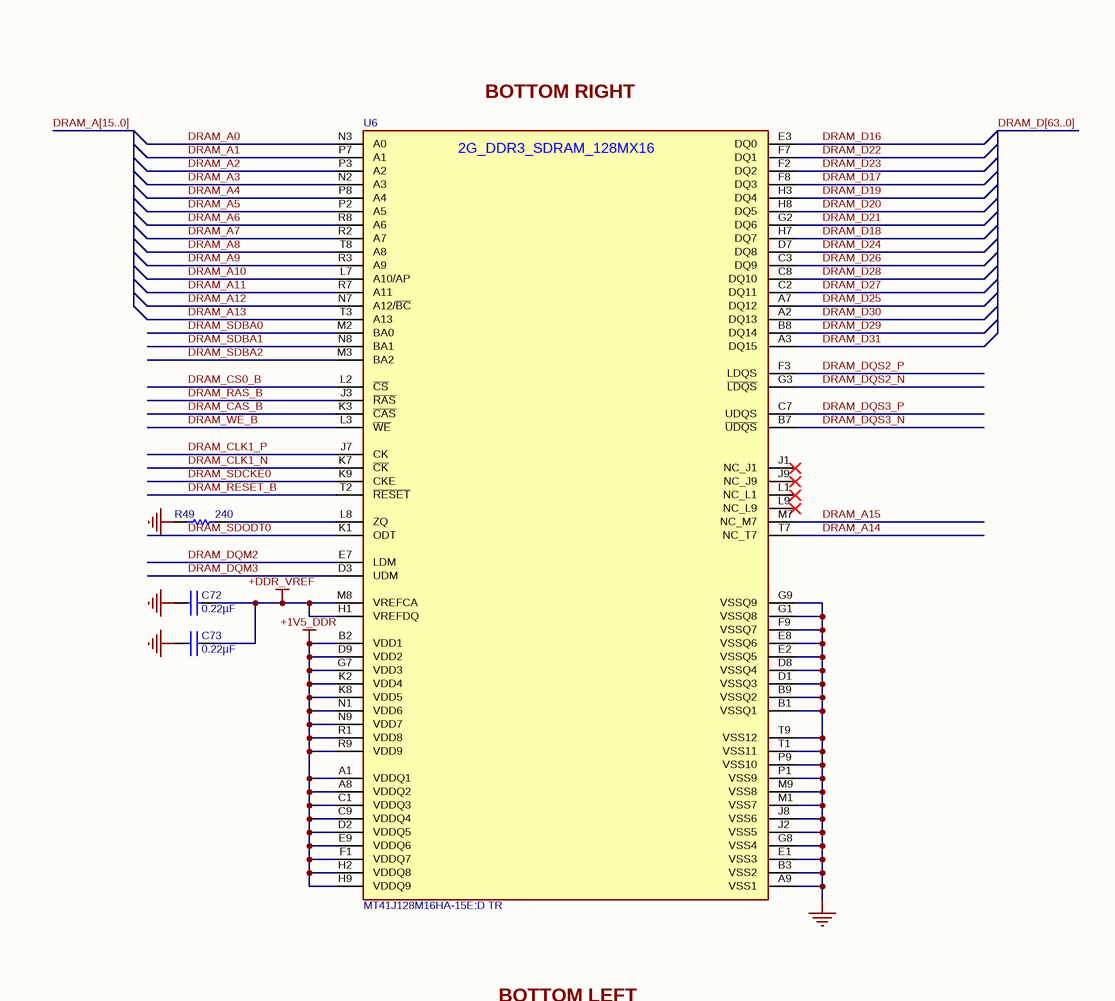
[diagram p24: EDU_High-Speed-Design_DDR3.SchDoc, top right]
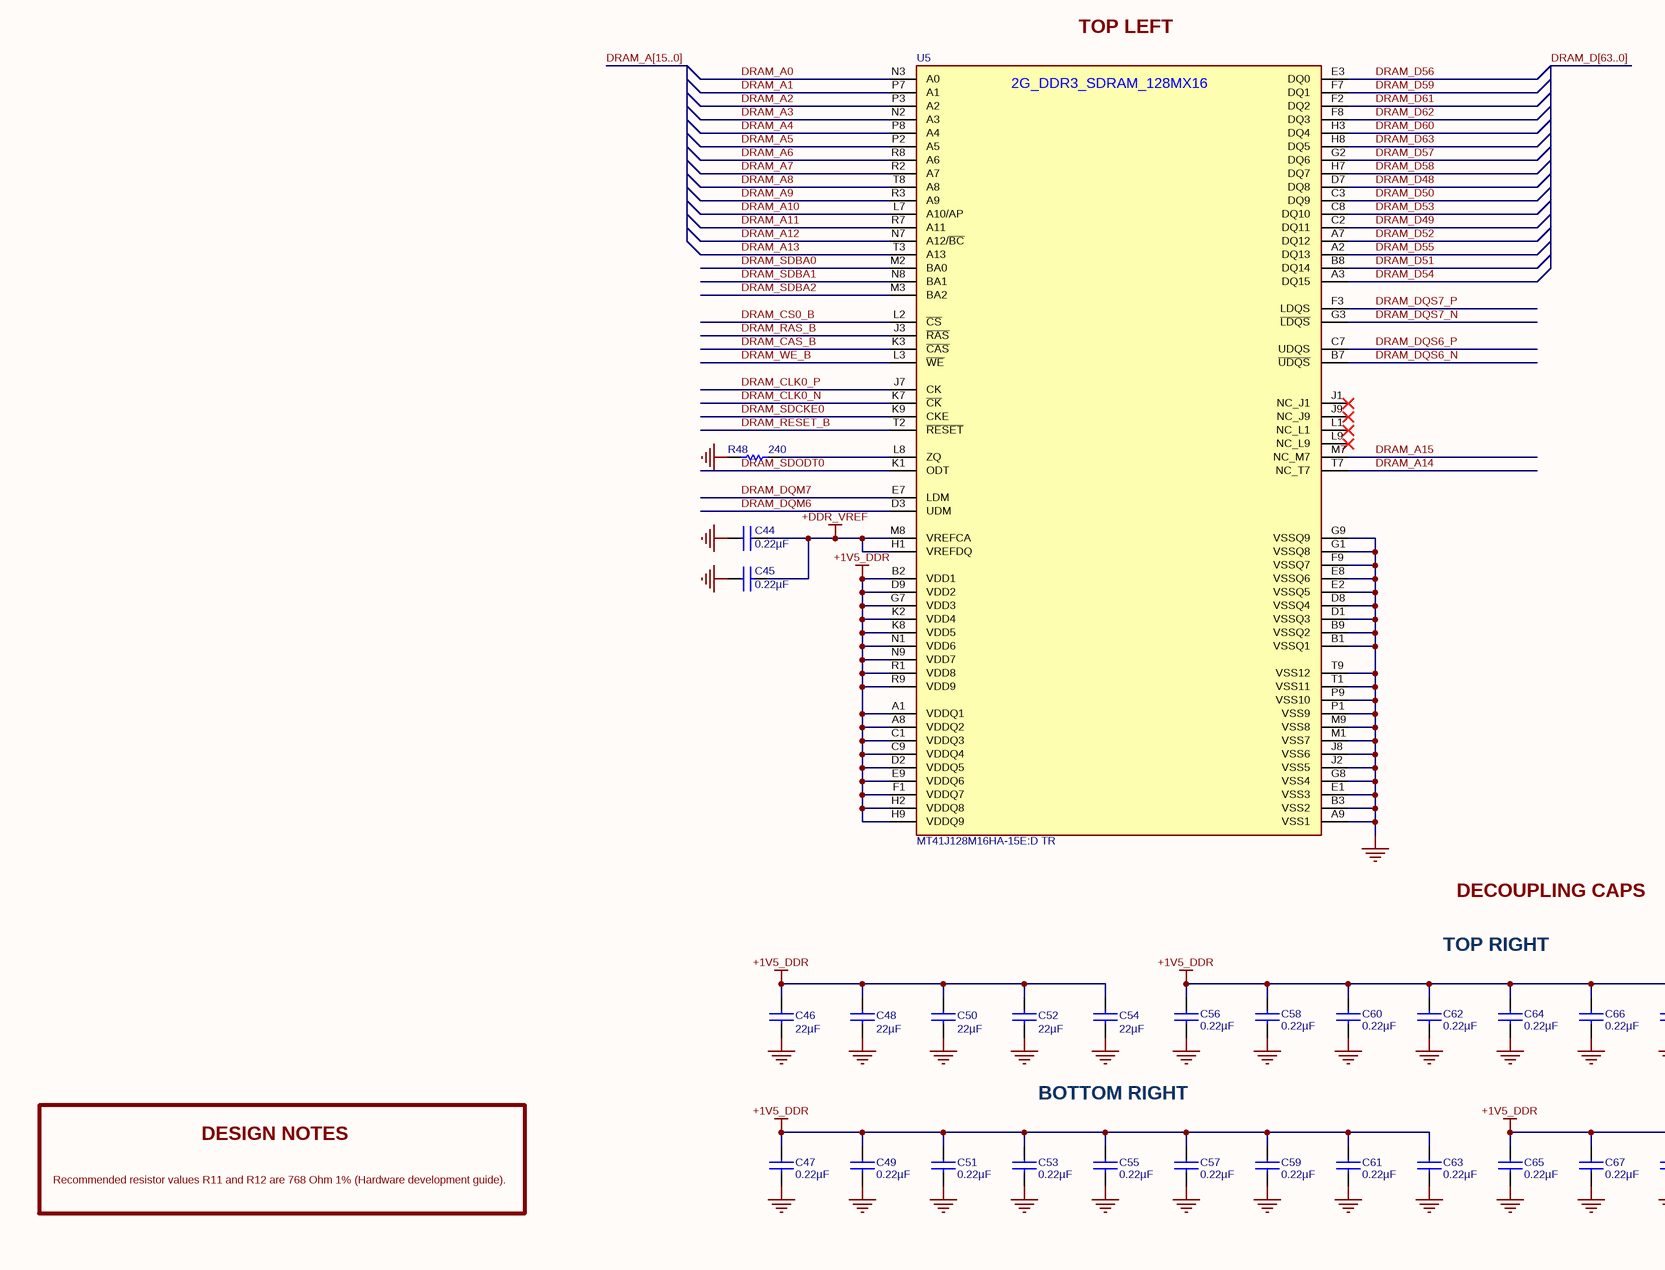
[diagram p25: EDU_High-Speed-Design_DDR3.SchDoc, bottom left]
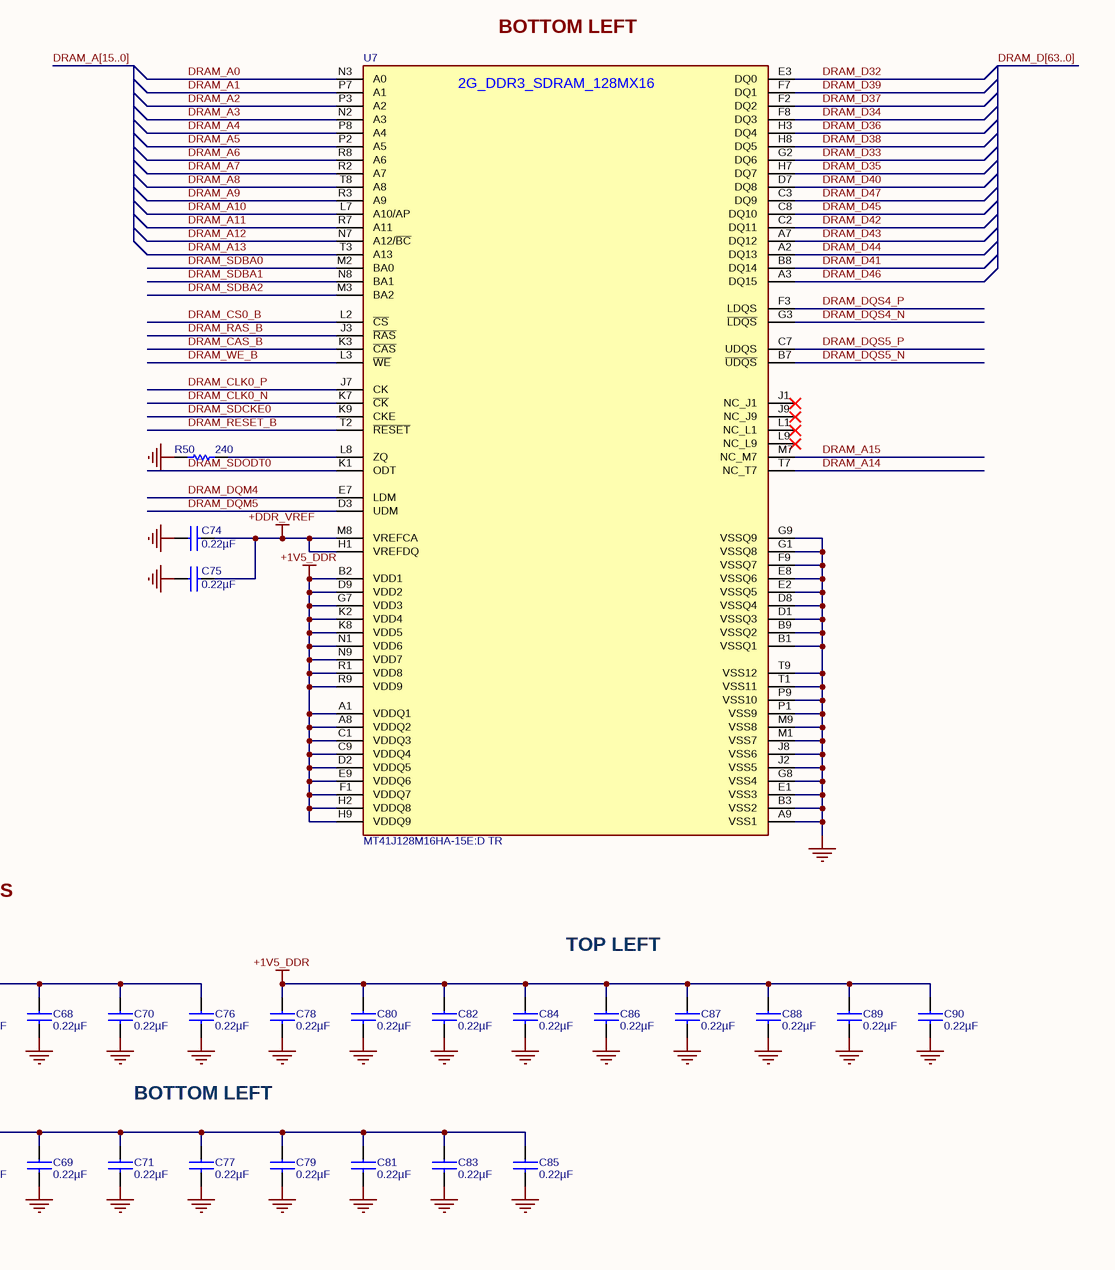
[diagram p26: EDU_High-Speed-Design_DDR3.SchDoc, bottom right]

### Parts
C42  0.22µF  [C0402]
C43  0.22µF  [C0402]
C44  0.22µF  [C0402]
C45  0.22µF  [C0402]
C46  22µF  [C0603]
C47  0.22µF  [C0402]
C48  22µF  [C0603]
C49  0.22µF  [C0402]
C50  22µF  [C0603]
C51  0.22µF  [C0402]
C52  22µF  [C0603]
C53  0.22µF  [C0402]
C54  22µF  [C0603]
C55  0.22µF  [C0402]
C56  0.22µF  [C0402]
C57  0.22µF  [C0402]
C58  0.22µF  [C0402]
C59  0.22µF  [C0402]
C60  0.22µF  [C0402]
C61  0.22µF  [C0402]
C62  0.22µF  [C0402]
C63  0.22µF  [C0402]
C64  0.22µF  [C0402]
C65  0.22µF  [C0402]
C66  0.22µF  [C0402]
C67  0.22µF  [C0402]
C68  0.22µF  [C0402]
C69  0.22µF  [C0402]
C70  0.22µF  [C0402]
C71  0.22µF  [C0402]
C72  0.22µF  [C0402]
C73  0.22µF  [C0402]
C74  0.22µF  [C0402]
C75  0.22µF  [C0402]
C76  0.22µF  [C0402]
C77  0.22µF  [C0402]
C78  0.22µF  [C0402]
C79  0.22µF  [C0402]
C80  0.22µF  [C0402]
C81  0.22µF  [C0402]
C82  0.22µF  [C0402]
C83  0.22µF  [C0402]
C84  0.22µF  [C0402]
C85  0.22µF  [C0402]
C86  0.22µF  [C0402]
C87  0.22µF  [C0402]
C88  0.22µF  [C0402]
C89  0.22µF  [C0402]
C90  0.22µF  [C0402]
R47  240  [R0402]
R48  240  [R0402]
R49  240  [R0402]
R50  240  [R0402]
U4  MT41J128M16HA-15E:D TR  [MT41J128M16HA-15E:D TR]
U5  MT41J128M16HA-15E:D TR  [MT41J128M16HA-15E:D TR]
U6  MT41J128M16HA-15E:D TR  [MT41J128M16HA-15E:D TR]
U7  MT41J128M16HA-15E:D TR  [MT41J128M16HA-15E:D TR]

### Ports
+1V5_DDR (in), +DDR_VREF (in), DRAM (bidir, harness DRAM)

### Harnesses
DRAM: DRAM_SDCKE0, DRAM_RESET_B, DRAM_CLK0_N, DRAM_CLK1_N, DRAM_CLK1_P, DRAM_SDODT0, DRAM_CS0_B, DRAM_RAS_B, DRAM_CAS_B, DRAM_WE_B, DRAM_A[15..0], DRAM_SDBA0, DRAM_SDBA1, DRAM_SDBA2, DRAM_CLK0_P, DRAM_D[63..0], DRAM_DQS0_P, DRAM_DQS0_N, DRAM_DQM0, DRAM_DQS1_P, DRAM_DQS1_N, DRAM_DQM1, DRAM_DQS2_P, DRAM_DQS2_N, DRAM_DQM2, DRAM_DQS3_P, DRAM_DQS3_N, DRAM_DQM3, DRAM_DQS4_P, DRAM_DQS4_N, DRAM_DQM4, DRAM_DQS5_P, DRAM_DQS5_N, DRAM_DQM5, DRAM_DQS6_P, DRAM_DQS6_N, DRAM_DQM6, DRAM_DQS7_P, DRAM_DQS7_N, DRAM_DQM7

### Nets
+1V5_DDR: C46.1 C47.1 C48.1 C49.1 C50.1 C51.1 C52.1 C53.1 C54.1 C55.1 C56.1 C57.1 C58.1 C59.1 C60.1 C61.1 C62.1 C63.1 C64.1 C65.1 C66.1 C67.1 C68.1 C69.1 C70.1 C71.1 C76.1 C77.1 C78.1 C79.1 C80.1 C81.1 C82.1 C83.1 C84.1 C85.1 C86.1 C87.1 C88.1 C89.1 C90.1 U4.A1(VDDQ1) U4.A8(VDDQ2) U4.B2(VDD1) U4.C1(VDDQ3) U4.C9(VDDQ4) U4.D2(VDDQ5) U4.D9(VDD2) U4.E9(VDDQ6) U4.F1(VDDQ7) U4.G7(VDD3) U4.H2(VDDQ8) U4.H9(VDDQ9) U4.K2(VDD4) U4.K8(VDD5) U4.N1(VDD6) U4.N9(VDD7) U4.R1(VDD8) U4.R9(VDD9) U5.A1(VDDQ1) U5.A8(VDDQ2) U5.B2(VDD1) U5.C1(VDDQ3) U5.C9(VDDQ4) U5.D2(VDDQ5) U5.D9(VDD2) U5.E9(VDDQ6) U5.F1(VDDQ7) U5.G7(VDD3) U5.H2(VDDQ8) U5.H9(VDDQ9) U5.K2(VDD4) U5.K8(VDD5) U5.N1(VDD6) U5.N9(VDD7) U5.R1(VDD8) U5.R9(VDD9) U6.A1(VDDQ1) U6.A8(VDDQ2) U6.B2(VDD1) U6.C1(VDDQ3) U6.C9(VDDQ4) U6.D2(VDDQ5) U6.D9(VDD2) U6.E9(VDDQ6) U6.F1(VDDQ7) U6.G7(VDD3) U6.H2(VDDQ8) U6.H9(VDDQ9) U6.K2(VDD4) U6.K8(VDD5) U6.N1(VDD6) U6.N9(VDD7) U6.R1(VDD8) U6.R9(VDD9) U7.A1(VDDQ1) U7.A8(VDDQ2) U7.B2(VDD1) U7.C1(VDDQ3) U7.C9(VDDQ4) U7.D2(VDDQ5) U7.D9(VDD2) U7.E9(VDDQ6) U7.F1(VDDQ7) U7.G7(VDD3) U7.H2(VDDQ8) U7.H9(VDDQ9) U7.K2(VDD4) U7.K8(VDD5) U7.N1(VDD6) U7.N9(VDD7) U7.R1(VDD8) U7.R9(VDD9) ; port +1V5_DDR
+DDR_VREF: C42.2 C43.2 C44.2 C45.2 C72.2 C73.2 C74.2 C75.2 U4.H1(VREFDQ) U4.M8(VREFCA) U5.H1(VREFDQ) U5.M8(VREFCA) U6.H1(VREFDQ) U6.M8(VREFCA) U7.H1(VREFDQ) U7.M8(VREFCA) ; port +DDR_VREF
GND: C42.1 C43.1 C44.1 C45.1 C46.2 C47.2 C48.2 C49.2 C50.2 C51.2 C52.2 C53.2 C54.2 C55.2 C56.2 C57.2 C58.2 C59.2 C60.2 C61.2 C62.2 C63.2 C64.2 C65.2 C66.2 C67.2 C68.2 C69.2 C70.2 C71.2 C72.1 C73.1 C74.1 C75.1 C76.2 C77.2 C78.2 C79.2 C80.2 C81.2 C82.2 C83.2 C84.2 C85.2 C86.2 C87.2 C88.2 C89.2 C90.2 R47.2 R48.2 R49.2 R50.2 U4.A9(VSS1) U4.B1(VSSQ1) U4.B3(VSS2) U4.B9(VSSQ2) U4.D1(VSSQ3) U4.D8(VSSQ4) U4.E1(VSS3) U4.E2(VSSQ5) U4.E8(VSSQ6) U4.F9(VSSQ7) U4.G1(VSSQ8) U4.G8(VSS4) U4.G9(VSSQ9) U4.J2(VSS5) U4.J8(VSS6) U4.M1(VSS7) U4.M9(VSS8) U4.P1(VSS9) U4.P9(VSS10) U4.T1(VSS11) U4.T9(VSS12) U5.A9(VSS1) U5.B1(VSSQ1) U5.B3(VSS2) U5.B9(VSSQ2) U5.D1(VSSQ3) U5.D8(VSSQ4) U5.E1(VSS3) U5.E2(VSSQ5) U5.E8(VSSQ6) U5.F9(VSSQ7) U5.G1(VSSQ8) U5.G8(VSS4) U5.G9(VSSQ9) U5.J2(VSS5) U5.J8(VSS6) U5.M1(VSS7) U5.M9(VSS8) U5.P1(VSS9) U5.P9(VSS10) U5.T1(VSS11) U5.T9(VSS12) U6.A9(VSS1) U6.B1(VSSQ1) U6.B3(VSS2) U6.B9(VSSQ2) U6.D1(VSSQ3) U6.D8(VSSQ4) U6.E1(VSS3) U6.E2(VSSQ5) U6.E8(VSSQ6) U6.F9(VSSQ7) U6.G1(VSSQ8) U6.G8(VSS4) U6.G9(VSSQ9) U6.J2(VSS5) U6.J8(VSS6) U6.M1(VSS7) U6.M9(VSS8) U6.P1(VSS9) U6.P9(VSS10) U6.T1(VSS11) U6.T9(VSS12) U7.A9(VSS1) U7.B1(VSSQ1) U7.B3(VSS2) U7.B9(VSSQ2) U7.D1(VSSQ3) U7.D8(VSSQ4) U7.E1(VSS3) U7.E2(VSSQ5) U7.E8(VSSQ6) U7.F9(VSSQ7) U7.G1(VSSQ8) U7.G8(VSS4) U7.G9(VSSQ9) U7.J2(VSS5) U7.J8(VSS6) U7.M1(VSS7) U7.M9(VSS8) U7.P1(VSS9) U7.P9(VSS10) U7.T1(VSS11) U7.T9(VSS12)
DRAM_A0: U4.N3(A0) U5.N3(A0) U6.N3(A0) U7.N3(A0)
DRAM_A1: U4.P7(A1) U5.P7(A1) U6.P7(A1) U7.P7(A1)
DRAM_A2: U4.P3(A2) U5.P3(A2) U6.P3(A2) U7.P3(A2)
DRAM_A3: U4.N2(A3) U5.N2(A3) U6.N2(A3) U7.N2(A3)
DRAM_A4: U4.P8(A4) U5.P8(A4) U6.P8(A4) U7.P8(A4)
DRAM_A5: U4.P2(A5) U5.P2(A5) U6.P2(A5) U7.P2(A5)
DRAM_A6: U4.R8(A6) U5.R8(A6) U6.R8(A6) U7.R8(A6)
DRAM_A7: U4.R2(A7) U5.R2(A7) U6.R2(A7) U7.R2(A7)
DRAM_A8: U4.T8(A8) U5.T8(A8) U6.T8(A8) U7.T8(A8)
DRAM_A9: U4.R3(A9) U5.R3(A9) U6.R3(A9) U7.R3(A9)
DRAM_A10: U4.L7(A10/AP) U5.L7(A10/AP) U6.L7(A10/AP) U7.L7(A10/AP)
DRAM_A11: U4.R7(A11) U5.R7(A11) U6.R7(A11) U7.R7(A11)
DRAM_A12: U4.N7(A12/~{BC}) U5.N7(A12/~{BC}) U6.N7(A12/~{BC}) U7.N7(A12/~{BC})
DRAM_A13: U4.T3(A13) U5.T3(A13) U6.T3(A13) U7.T3(A13)
DRAM_A14: U4.T7(NC_T7) U5.T7(NC_T7) U6.T7(NC_T7) U7.T7(NC_T7)
DRAM_A15: U4.M7(NC_M7) U5.M7(NC_M7) U6.M7(NC_M7) U7.M7(NC_M7)
DRAM_CAS_B: U4.K3(~{CAS}) U5.K3(~{CAS}) U6.K3(~{CAS}) U7.K3(~{CAS}) ; port DRAM.DRAM_CAS_B
DRAM_CLK0_N: U5.K7(~{CK}) U7.K7(~{CK}) ; port DRAM.DRAM_CLK0_N
DRAM_CLK0_P: U5.J7(CK) U7.J7(CK) ; port DRAM.DRAM_CLK0_P
DRAM_CLK1_N: U4.K7(~{CK}) U6.K7(~{CK}) ; port DRAM.DRAM_CLK1_N
DRAM_CLK1_P: U4.J7(CK) U6.J7(CK) ; port DRAM.DRAM_CLK1_P
DRAM_CS0_B: U4.L2(~{CS}) U5.L2(~{CS}) U6.L2(~{CS}) U7.L2(~{CS}) ; port DRAM.DRAM_CS0_B
DRAM_D0: U4.D7(DQ8)
DRAM_D1: U4.B8(DQ14)
DRAM_D2: U4.C8(DQ10)
DRAM_D3: U4.A3(DQ15)
DRAM_D4: U4.C2(DQ11)
DRAM_D5: U4.C3(DQ9)
DRAM_D6: U4.A2(DQ13)
DRAM_D7: U4.A7(DQ12)
DRAM_D8: U4.E3(DQ0)
DRAM_D9: U4.F7(DQ1)
DRAM_D10: U4.G2(DQ6)
DRAM_D11: U4.H7(DQ7)
DRAM_D12: U4.H3(DQ4)
DRAM_D13: U4.F2(DQ2)
DRAM_D14: U4.F8(DQ3)
DRAM_D15: U4.H8(DQ5)
DRAM_D16: U6.E3(DQ0)
DRAM_D17: U6.F8(DQ3)
DRAM_D18: U6.H7(DQ7)
DRAM_D19: U6.H3(DQ4)
DRAM_D20: U6.H8(DQ5)
DRAM_D21: U6.G2(DQ6)
DRAM_D22: U6.F7(DQ1)
DRAM_D23: U6.F2(DQ2)
DRAM_D24: U6.D7(DQ8)
DRAM_D25: U6.A7(DQ12)
DRAM_D26: U6.C3(DQ9)
DRAM_D27: U6.C2(DQ11)
DRAM_D28: U6.C8(DQ10)
DRAM_D29: U6.B8(DQ14)
DRAM_D30: U6.A2(DQ13)
DRAM_D31: U6.A3(DQ15)
DRAM_D32: U7.E3(DQ0)
DRAM_D33: U7.G2(DQ6)
DRAM_D34: U7.F8(DQ3)
DRAM_D35: U7.H7(DQ7)
DRAM_D36: U7.H3(DQ4)
DRAM_D37: U7.F2(DQ2)
DRAM_D38: U7.H8(DQ5)
DRAM_D39: U7.F7(DQ1)
DRAM_D40: U7.D7(DQ8)
DRAM_D41: U7.B8(DQ14)
DRAM_D42: U7.C2(DQ11)
DRAM_D43: U7.A7(DQ12)
DRAM_D44: U7.A2(DQ13)
DRAM_D45: U7.C8(DQ10)
DRAM_D46: U7.A3(DQ15)
DRAM_D47: U7.C3(DQ9)
DRAM_D48: U5.D7(DQ8)
DRAM_D49: U5.C2(DQ11)
DRAM_D50: U5.C3(DQ9)
DRAM_D51: U5.B8(DQ14)
DRAM_D52: U5.A7(DQ12)
DRAM_D53: U5.C8(DQ10)
DRAM_D54: U5.A3(DQ15)
DRAM_D55: U5.A2(DQ13)
DRAM_D56: U5.E3(DQ0)
DRAM_D57: U5.G2(DQ6)
DRAM_D58: U5.H7(DQ7)
DRAM_D59: U5.F7(DQ1)
DRAM_D60: U5.H3(DQ4)
DRAM_D61: U5.F2(DQ2)
DRAM_D62: U5.F8(DQ3)
DRAM_D63: U5.H8(DQ5)
DRAM_DQM0: U4.D3(UDM) ; port DRAM.DRAM_DQM0
DRAM_DQM1: U4.E7(LDM) ; port DRAM.DRAM_DQM1
DRAM_DQM2: U6.E7(LDM) ; port DRAM.DRAM_DQM2
DRAM_DQM3: U6.D3(UDM) ; port DRAM.DRAM_DQM3
DRAM_DQM4: U7.E7(LDM) ; port DRAM.DRAM_DQM4
DRAM_DQM5: U7.D3(UDM) ; port DRAM.DRAM_DQM5
DRAM_DQM6: U5.D3(UDM) ; port DRAM.DRAM_DQM6
DRAM_DQM7: U5.E7(LDM) ; port DRAM.DRAM_DQM7
DRAM_DQS0_N: U4.B7(~{UDQS}) ; port DRAM.DRAM_DQS0_N
DRAM_DQS0_P: U4.C7(UDQS) ; port DRAM.DRAM_DQS0_P
DRAM_DQS1_N: U4.G3(~{LDQS}) ; port DRAM.DRAM_DQS1_N
DRAM_DQS1_P: U4.F3(LDQS) ; port DRAM.DRAM_DQS1_P
DRAM_DQS2_N: U6.G3(~{LDQS}) ; port DRAM.DRAM_DQS2_N
DRAM_DQS2_P: U6.F3(LDQS) ; port DRAM.DRAM_DQS2_P
DRAM_DQS3_N: U6.B7(~{UDQS}) ; port DRAM.DRAM_DQS3_N
DRAM_DQS3_P: U6.C7(UDQS) ; port DRAM.DRAM_DQS3_P
DRAM_DQS4_N: U7.G3(~{LDQS}) ; port DRAM.DRAM_DQS4_N
DRAM_DQS4_P: U7.F3(LDQS) ; port DRAM.DRAM_DQS4_P
DRAM_DQS5_N: U7.B7(~{UDQS}) ; port DRAM.DRAM_DQS5_N
DRAM_DQS5_P: U7.C7(UDQS) ; port DRAM.DRAM_DQS5_P
DRAM_DQS6_N: U5.B7(~{UDQS}) ; port DRAM.DRAM_DQS6_N
DRAM_DQS6_P: U5.C7(UDQS) ; port DRAM.DRAM_DQS6_P
DRAM_DQS7_N: U5.G3(~{LDQS}) ; port DRAM.DRAM_DQS7_N
DRAM_DQS7_P: U5.F3(LDQS) ; port DRAM.DRAM_DQS7_P
DRAM_RAS_B: U4.J3(~{RAS}) U5.J3(~{RAS}) U6.J3(~{RAS}) U7.J3(~{RAS}) ; port DRAM.DRAM_RAS_B
DRAM_RESET_B: U4.T2(~{RESET}) U5.T2(~{RESET}) U6.T2(~{RESET}) U7.T2(~{RESET}) ; port DRAM.DRAM_RESET_B
DRAM_SDBA0: U4.M2(BA0) U5.M2(BA0) U6.M2(BA0) U7.M2(BA0) ; port DRAM.DRAM_SDBA0
DRAM_SDBA1: U4.N8(BA1) U5.N8(BA1) U6.N8(BA1) U7.N8(BA1) ; port DRAM.DRAM_SDBA1
DRAM_SDBA2: U4.M3(BA2) U5.M3(BA2) U6.M3(BA2) U7.M3(BA2) ; port DRAM.DRAM_SDBA2
DRAM_SDCKE0: U4.K9(CKE) U5.K9(CKE) U6.K9(CKE) U7.K9(CKE) ; port DRAM.DRAM_SDCKE0
DRAM_SDODT0: U4.K1(ODT) U5.K1(ODT) U6.K1(ODT) U7.K1(ODT) ; port DRAM.DRAM_SDODT0
DRAM_WE_B: U4.L3(~{WE}) U5.L3(~{WE}) U6.L3(~{WE}) U7.L3(~{WE}) ; port DRAM.DRAM_WE_B
NetR47_1: R47.1 U4.L8(ZQ)
NetR48_1: R48.1 U5.L8(ZQ)
NetR49_1: R49.1 U6.L8(ZQ)
NetR50_1: R50.1 U7.L8(ZQ)

Not connected (* = marked no-connect by the designer): U4 J1(NC_J1)* J9(NC_J9)* L1(NC_L1)* L9(NC_L9)*; U5 J1(NC_J1)* J9(NC_J9)* L1(NC_L1)* L9(NC_L9)*; U6 J1(NC_J1)* J9(NC_J9)* L1(NC_L1)* L9(NC_L9)*; U7 J1(NC_J1)* J9(NC_J9)* L1(NC_L1)* L9(NC_L9)*

### Buses and harness runs
bus DRAM_A[15..0]
bus DRAM_D[63..0]

### Notes on the sheet
- (near U4) TOP RIGHT
- (near U6) BOTTOM RIGHT
- DRAM
- (near U5) TOP LEFT
- (near U7) BOTTOM LEFT
- DECOUPLING CAPS
- TOP RIGHT
- TOP LEFT
- BOTTOM RIGHT
- BOTTOM LEFT
- DESIGN NOTES
- Recommended resistor values R11 and R12 are 768 Ohm 1% (Hardware development guide).
- Title:
- Date:
- Size C
- Project:
- Number:
- Time:
- Sheet
- Revision
- of
- Engineer:
- File:
- (in symbol MT41J128M16HA-15E:D TR) 2G_DDR3_SDRAM_128MX16

### Library data of the parts
C42-C45 C47 C49 C51 C53 C55-C90 = C1005X5R1E224M: CAP CER .22UF 25V X5R 20% 0402; Manufacturer 1: TDK Corporation; Capacitance: 0.22µF; Manufacturer Part Number 1: C1005X5R1E224M; Voltage: 25V; Supplier 1: Digi-Key; Supplier Part Number 1: 445-5945-1-ND; ComponentLink1URL: http://www.tdk.co.jp/tefe02/e412_c.pdf; ComponentLink1Description: http://www.tdk.co.jp/tefe02/e412_c.pdf
C46 C48 C50 C52 C54 = GRM188R60G226MEA0L: CAP CER 22UF 4V 20% X5R 0603; Manufacturer 1: Murata Electronics North America; Supplier 1: Digi-Key; Supplier Part Number 1: 490-5526-1-ND; Manufacturer Part Number 1: GRM188R60G226MEA0L; Capacitance: 22µF; Voltage: 4V; ComponentLink1URL: http://www.murata.com/products/catalog/pdf/c02e.pdf; ComponentLink1Description: http://www.murata.com/products/catalog/pdf/c02e.pdf
R47-R50 = RMCF0402FT240R: RES TF 240 OHM 1% 0.0625W 0402; Manufacturer 1: Stackpole Electronics Inc; Manufacturer Part Number 1: RMCF0402FT240R; Resistance: 240; Supplier 1: Digi-Key; Supplier Part Number 1: RMCF0402FT240RCT-ND; ComponentLink1URL: http://www.seielect.com/Catalog/SEI-RMCF.pdf; ComponentLink1Description: http://www.seielect.com/Catalog/SEI-RMCF.pdf
U4-U7 = MT41J128M16HA-15E:D TR: IC DDR3 SDRAM 2GBIT 667MHZ 96BGA; Manufacturer 1: Micron Technology Inc; Supplier 1: Digi-Key; Manufacturer Part Number 1: MT41J128M16HA-15E:D TR; ComponentLink1URL: http://www.micron.com/~/media/Documents/Products/Data%20Sheet/DRAM/2Gb_DDR3_SDRAM.pdf; ComponentLink1Description: http://www.micron.com/~/media/Documents/Products/Data%20Sheet/DRAM/2Gb_DDR3_SDRAM.pdf; Supplier Part Number 1: 557-1493-1-ND

## Sheet EDU_High-Speed-Design_Power.SchDoc: Power
size 279 x 215 mm; Date: not used; ApprovedBy: not used; CheckedBy: not used; Author: not used; DrawnBy: not used; Engineer: Podlesnyi Vasilii; Organization: not used; Address4: not used; Revision: 0.1; SheetNumber: 2; SheetTotal: 26; ProjectTitle: EDU High-Speed Design; Time: not used; ImagePath: not used; Application_BuildNumber: not used
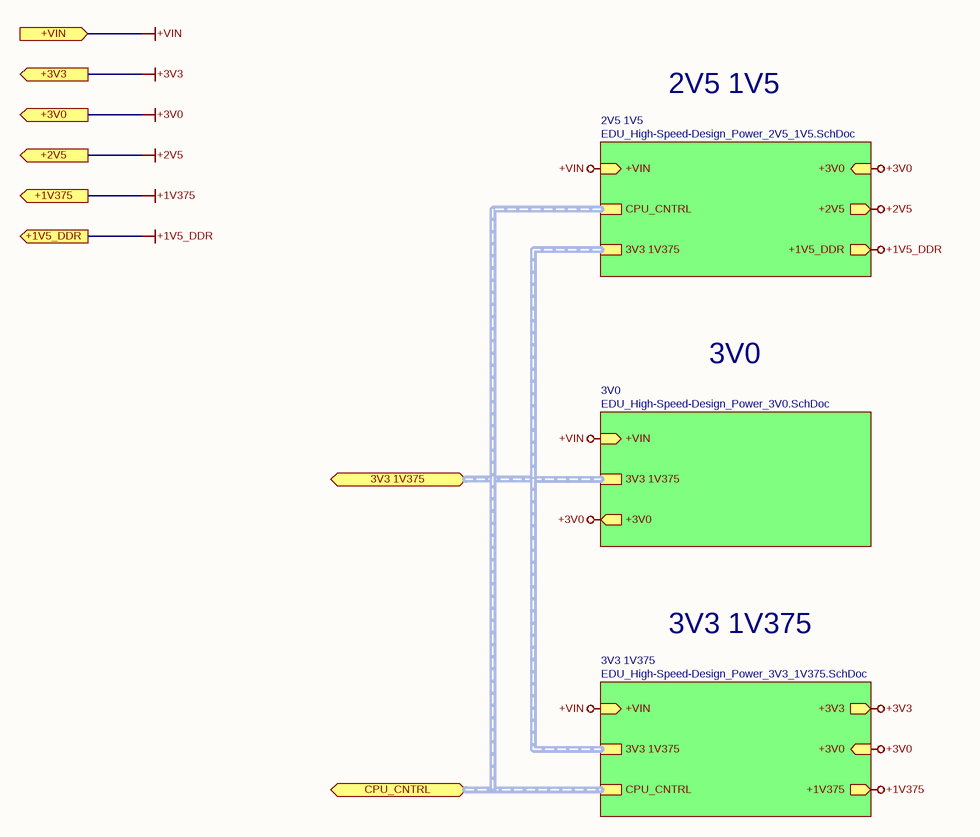
[diagram p27: EDU_High-Speed-Design_Power.SchDoc]

### Sub-sheets
2V5 1V5 = EDU_High-Speed-Design_Power_2V5_1V5.SchDoc: +VIN (in), +3V0 (in), +1V5_DDR (out), +2V5 (out), 3V3 1V375 (harness 3V3 1V375), CPU_CNTRL (harness CPU_CNTRL)
3V0 = EDU_High-Speed-Design_Power_3V0.SchDoc: +VIN (in), +3V0 (out), 3V3 1V375 (harness 3V3 1V375)
3V3 1V375 = EDU_High-Speed-Design_Power_3V3_1V375.SchDoc: +VIN (in), +3V3 (out), +1V375 (out), +3V0 (in), 3V3 1V375 (harness 3V3 1V375), CPU_CNTRL (harness CPU_CNTRL)

### Ports
3V3 1V375 (bidir, harness 3V3 1V375), +1V5_DDR (out), +1V375 (out), +2V5 (out), +3V0 (out), +3V3 (out), +VIN (in), CPU_CNTRL (bidir, harness CPU_CNTRL)

### Nets
+1V5_DDR: port +1V5_DDR, sheet 2V5 1V5/+1V5_DDR
+1V375: port +1V375, sheet 3V3 1V375/+1V375
+2V5: port +2V5, sheet 2V5 1V5/+2V5
+3V0: port +3V0, sheet 3V3 1V375/+3V0, sheet 3V0/+3V0, sheet 2V5 1V5/+3V0
+3V3: port +3V3, sheet 3V3 1V375/+3V3
+VIN: port +VIN, sheet 3V3 1V375/+VIN, sheet 3V0/+VIN, sheet 2V5 1V5/+VIN

### Buses and harness runs
harness port 3V3 1V375 = sheet 2V5 1V5/3V3 1V375 = sheet 3V0/3V3 1V375 = sheet 3V3 1V375/3V3 1V375
harness port CPU_CNTRL = sheet 2V5 1V5/CPU_CNTRL = sheet 3V3 1V375/CPU_CNTRL

### Notes on the sheet
- 2V5 1V5
- 3V0
- 3V3 1V375
- Title:
- Date:
- Size A
- Project:
- Time:
- Sheet
- Revision
- of
- Engineer:
- File: